# Altium project 20E-Bringup.PrjPcb (part 1 of 2)
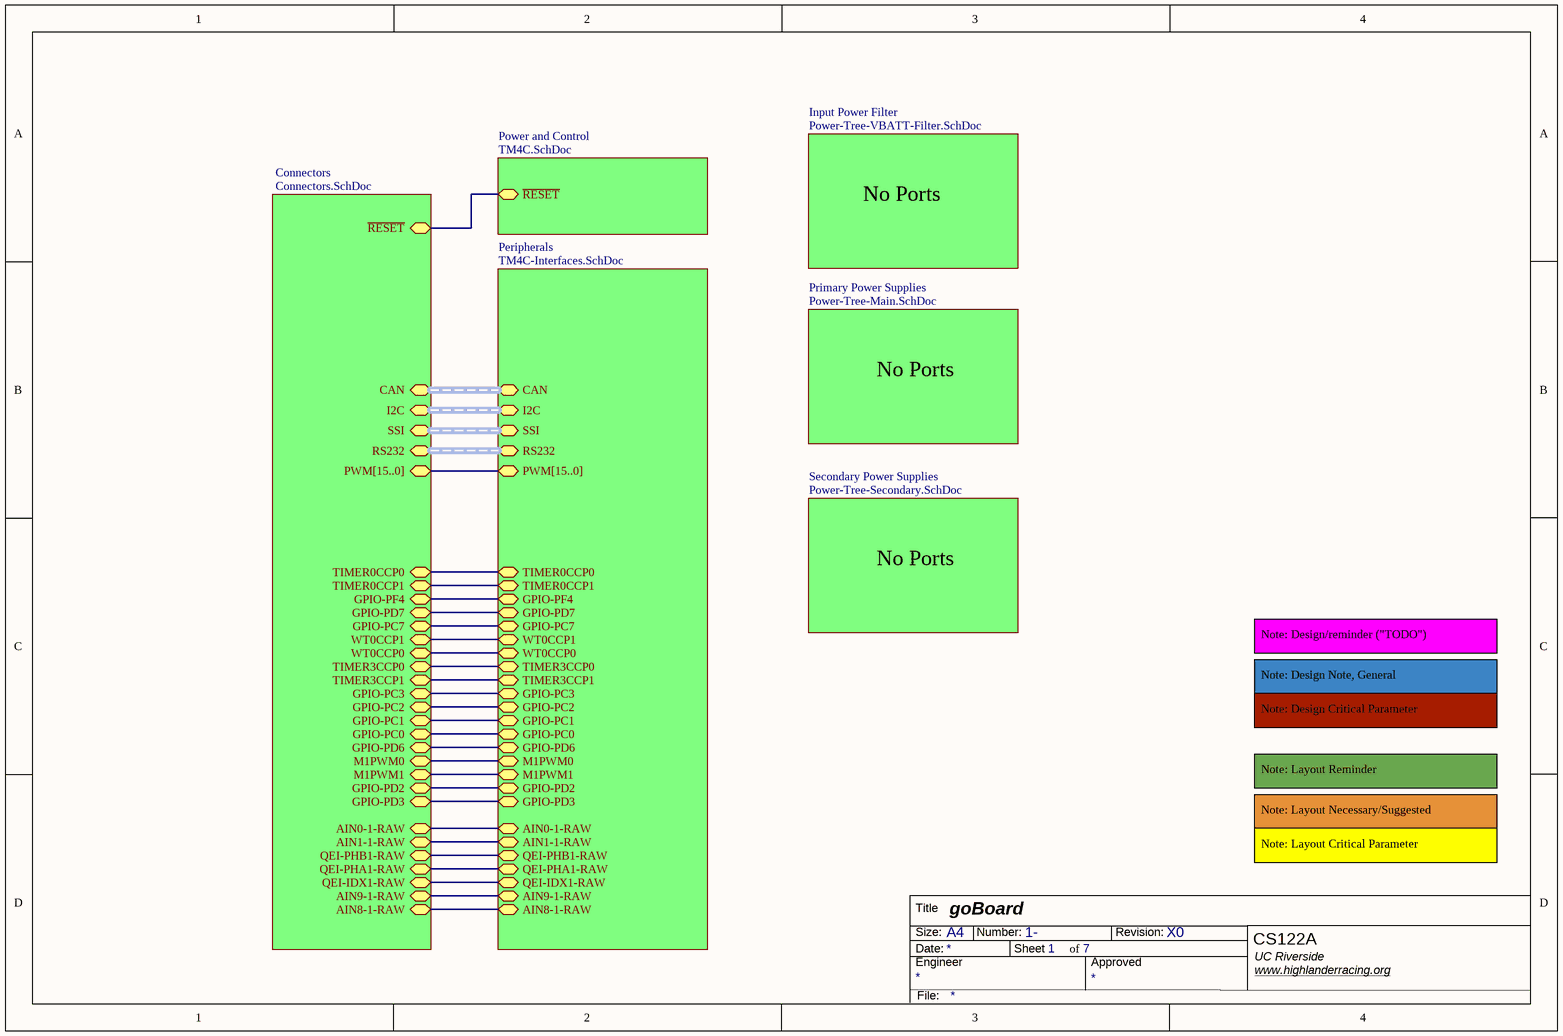
[diagram p0: System.SchDoc]
Revision: X0
12 sheets, 219 parts. Net scope: hierarchical (ports join the sheet entries above them; power ports are global).
Board files: dev-Carry-Rev0.PcbDoc, proto-rev0.PcbDoc
Sheets:
  System.SchDoc
    Connectors = Connectors.SchDoc
    Input Power Filter = Power-Tree-VBATT-Filter.SchDoc
    Primary Power Supplies = Power-Tree-Main.SchDoc
    Secondary Power Supplies = Power-Tree-Secondary.SchDoc
    Power and Control = TM4C.SchDoc
    Peripherals = TM4C-Interfaces.SchDoc
      CAN-Interface = CAN-Interface.SchDoc
      UART-Interface = UART-Interface.SchDoc
      I2C-Interface = I2C-Interface.SchDoc
      Pin-Filters = Pin-Filters.SchDoc
      PWM-Generator = PWM-Generator.SchDoc

## Sheet System.SchDoc: goBoard
size A4; Engineer: Paul Schneider; Organization: CS122A; DocumentNumber: 1-; Revision: X0; SheetNumber: 1; SheetTotal: 7; IsUserConfigurable: Yes

### Sub-sheets
Connectors = Connectors.SchDoc: CAN (bidir, harness CAN), TIMER0CCP0 (bidir), TIMER0CCP1 (bidir), GPIO-PF4 (bidir), GPIO-PD7 (bidir), GPIO-PC7 (bidir), WT0CCP1 (bidir), WT0CCP0 (bidir), TIMER3CCP0 (bidir), TIMER3CCP1 (bidir), GPIO-PC3 (bidir), GPIO-PC2 (bidir), GPIO-PC1 (bidir), GPIO-PC0 (bidir), GPIO-PD6 (bidir), M1PWM0 (bidir), M1PWM1 (bidir), GPIO-PD2 (bidir), GPIO-PD3 (bidir), AIN0-1-RAW (bidir), AIN1-1-RAW (bidir), QEI-PHB1-RAW (bidir), QEI-PHA1-RAW (bidir), QEI-IDX1-RAW (bidir), AIN9-1-RAW (bidir), AIN8-1-RAW (bidir), SSI (bidir, harness SSI), I2C (bidir, harness I2C), RS232 (bidir, harness RS232), PWM[15..0] (bidir), ~{RESET} (bidir)
Input Power Filter = Power-Tree-VBATT-Filter.SchDoc: no entries
Peripherals = TM4C-Interfaces.SchDoc: CAN (bidir, harness CAN), TIMER0CCP0 (bidir), TIMER0CCP1 (bidir), GPIO-PF4 (bidir), GPIO-PD7 (bidir), GPIO-PC7 (bidir), WT0CCP1 (bidir), WT0CCP0 (bidir), TIMER3CCP0 (bidir), TIMER3CCP1 (bidir), GPIO-PC3 (bidir), GPIO-PC2 (bidir), GPIO-PC1 (bidir), GPIO-PC0 (bidir), GPIO-PD6 (bidir), M1PWM0 (bidir), M1PWM1 (bidir), GPIO-PD2 (bidir), GPIO-PD3 (bidir), AIN0-1-RAW (bidir), AIN1-1-RAW (bidir), QEI-PHB1-RAW (bidir), QEI-PHA1-RAW (bidir), QEI-IDX1-RAW (bidir), AIN9-1-RAW (bidir), AIN8-1-RAW (bidir), PWM[15..0] (bidir), I2C (bidir, harness I2C), SSI (bidir, harness SSI), RS232 (bidir, harness RS232)
Power and Control = TM4C.SchDoc: ~{RESET} (bidir)
Primary Power Supplies = Power-Tree-Main.SchDoc: no entries
Secondary Power Supplies = Power-Tree-Secondary.SchDoc: no entries

### Nets
GPIO-PC0: sheet Connectors/GPIO-PC0, sheet Peripherals/GPIO-PC0
GPIO-PC1: sheet Connectors/GPIO-PC1, sheet Peripherals/GPIO-PC1
GPIO-PC2: sheet Connectors/GPIO-PC2, sheet Peripherals/GPIO-PC2
GPIO-PC3: sheet Connectors/GPIO-PC3, sheet Peripherals/GPIO-PC3
GPIO-PC7: sheet Connectors/GPIO-PC7, sheet Peripherals/GPIO-PC7
GPIO-PD2: sheet Connectors/GPIO-PD2, sheet Peripherals/GPIO-PD2
GPIO-PD3: sheet Connectors/GPIO-PD3, sheet Peripherals/GPIO-PD3
GPIO-PD6: sheet Connectors/GPIO-PD6, sheet Peripherals/GPIO-PD6
GPIO-PD7: sheet Connectors/GPIO-PD7, sheet Peripherals/GPIO-PD7
GPIO-PF4: sheet Connectors/GPIO-PF4, sheet Peripherals/GPIO-PF4
M1PWM0: sheet Connectors/M1PWM0, sheet Peripherals/M1PWM0
M1PWM1: sheet Connectors/M1PWM1, sheet Peripherals/M1PWM1
TIMER0CCP0: sheet Connectors/TIMER0CCP0, sheet Peripherals/TIMER0CCP0
TIMER0CCP1: sheet Connectors/TIMER0CCP1, sheet Peripherals/TIMER0CCP1
TIMER3CCP0: sheet Connectors/TIMER3CCP0, sheet Peripherals/TIMER3CCP0
TIMER3CCP1: sheet Connectors/TIMER3CCP1, sheet Peripherals/TIMER3CCP1
WT0CCP0: sheet Connectors/WT0CCP0, sheet Peripherals/WT0CCP0
WT0CCP1: sheet Connectors/WT0CCP1, sheet Peripherals/WT0CCP1
NetC4_2: sheet Connectors/~{RESET}, sheet Power and Control/~{RESET}
NetP21_1: sheet Connectors/QEI-IDX1-RAW, sheet Peripherals/QEI-IDX1-RAW
NetP21_2: sheet Connectors/AIN8-1-RAW, sheet Peripherals/AIN8-1-RAW
NetP21_3: sheet Connectors/QEI-PHA1-RAW, sheet Peripherals/QEI-PHA1-RAW
NetP21_4: sheet Connectors/AIN9-1-RAW, sheet Peripherals/AIN9-1-RAW
NetP21_5: sheet Connectors/QEI-PHB1-RAW, sheet Peripherals/QEI-PHB1-RAW
NetP21_6: sheet Connectors/AIN0-1-RAW, sheet Peripherals/AIN0-1-RAW
NetP21_8: sheet Connectors/AIN1-1-RAW, sheet Peripherals/AIN1-1-RAW

### Buses and harness runs
bus sheet Connectors/PWM[15..0] = sheet Peripherals/PWM[15..0]
harness sheet Connectors/CAN = sheet Peripherals/CAN
harness sheet Connectors/I2C = sheet Peripherals/I2C
harness sheet Connectors/RS232 = sheet Peripherals/RS232
harness sheet Connectors/SSI = sheet Peripherals/SSI

### Notes on the sheet
- No Ports
- Note: Design/reminder ("TODO")
- Note: Design Note, General
- Note: Design Critical Parameter
- Note: Layout Reminder
- Note: Layout Necessary/Suggested
- Note: Layout Critical Parameter
- Title
- Size:
- Date:
- Engineer
- A4
- Number:
- Sheet
- of
- Approved
- Revision:
- UC Riverside
- www.highlanderracing.org <https://www.highlanderracing.org>
- File:

## Sheet Connectors.SchDoc: HR20E
size A3; Organization: Highlander Racing; Address1: UC Riverside
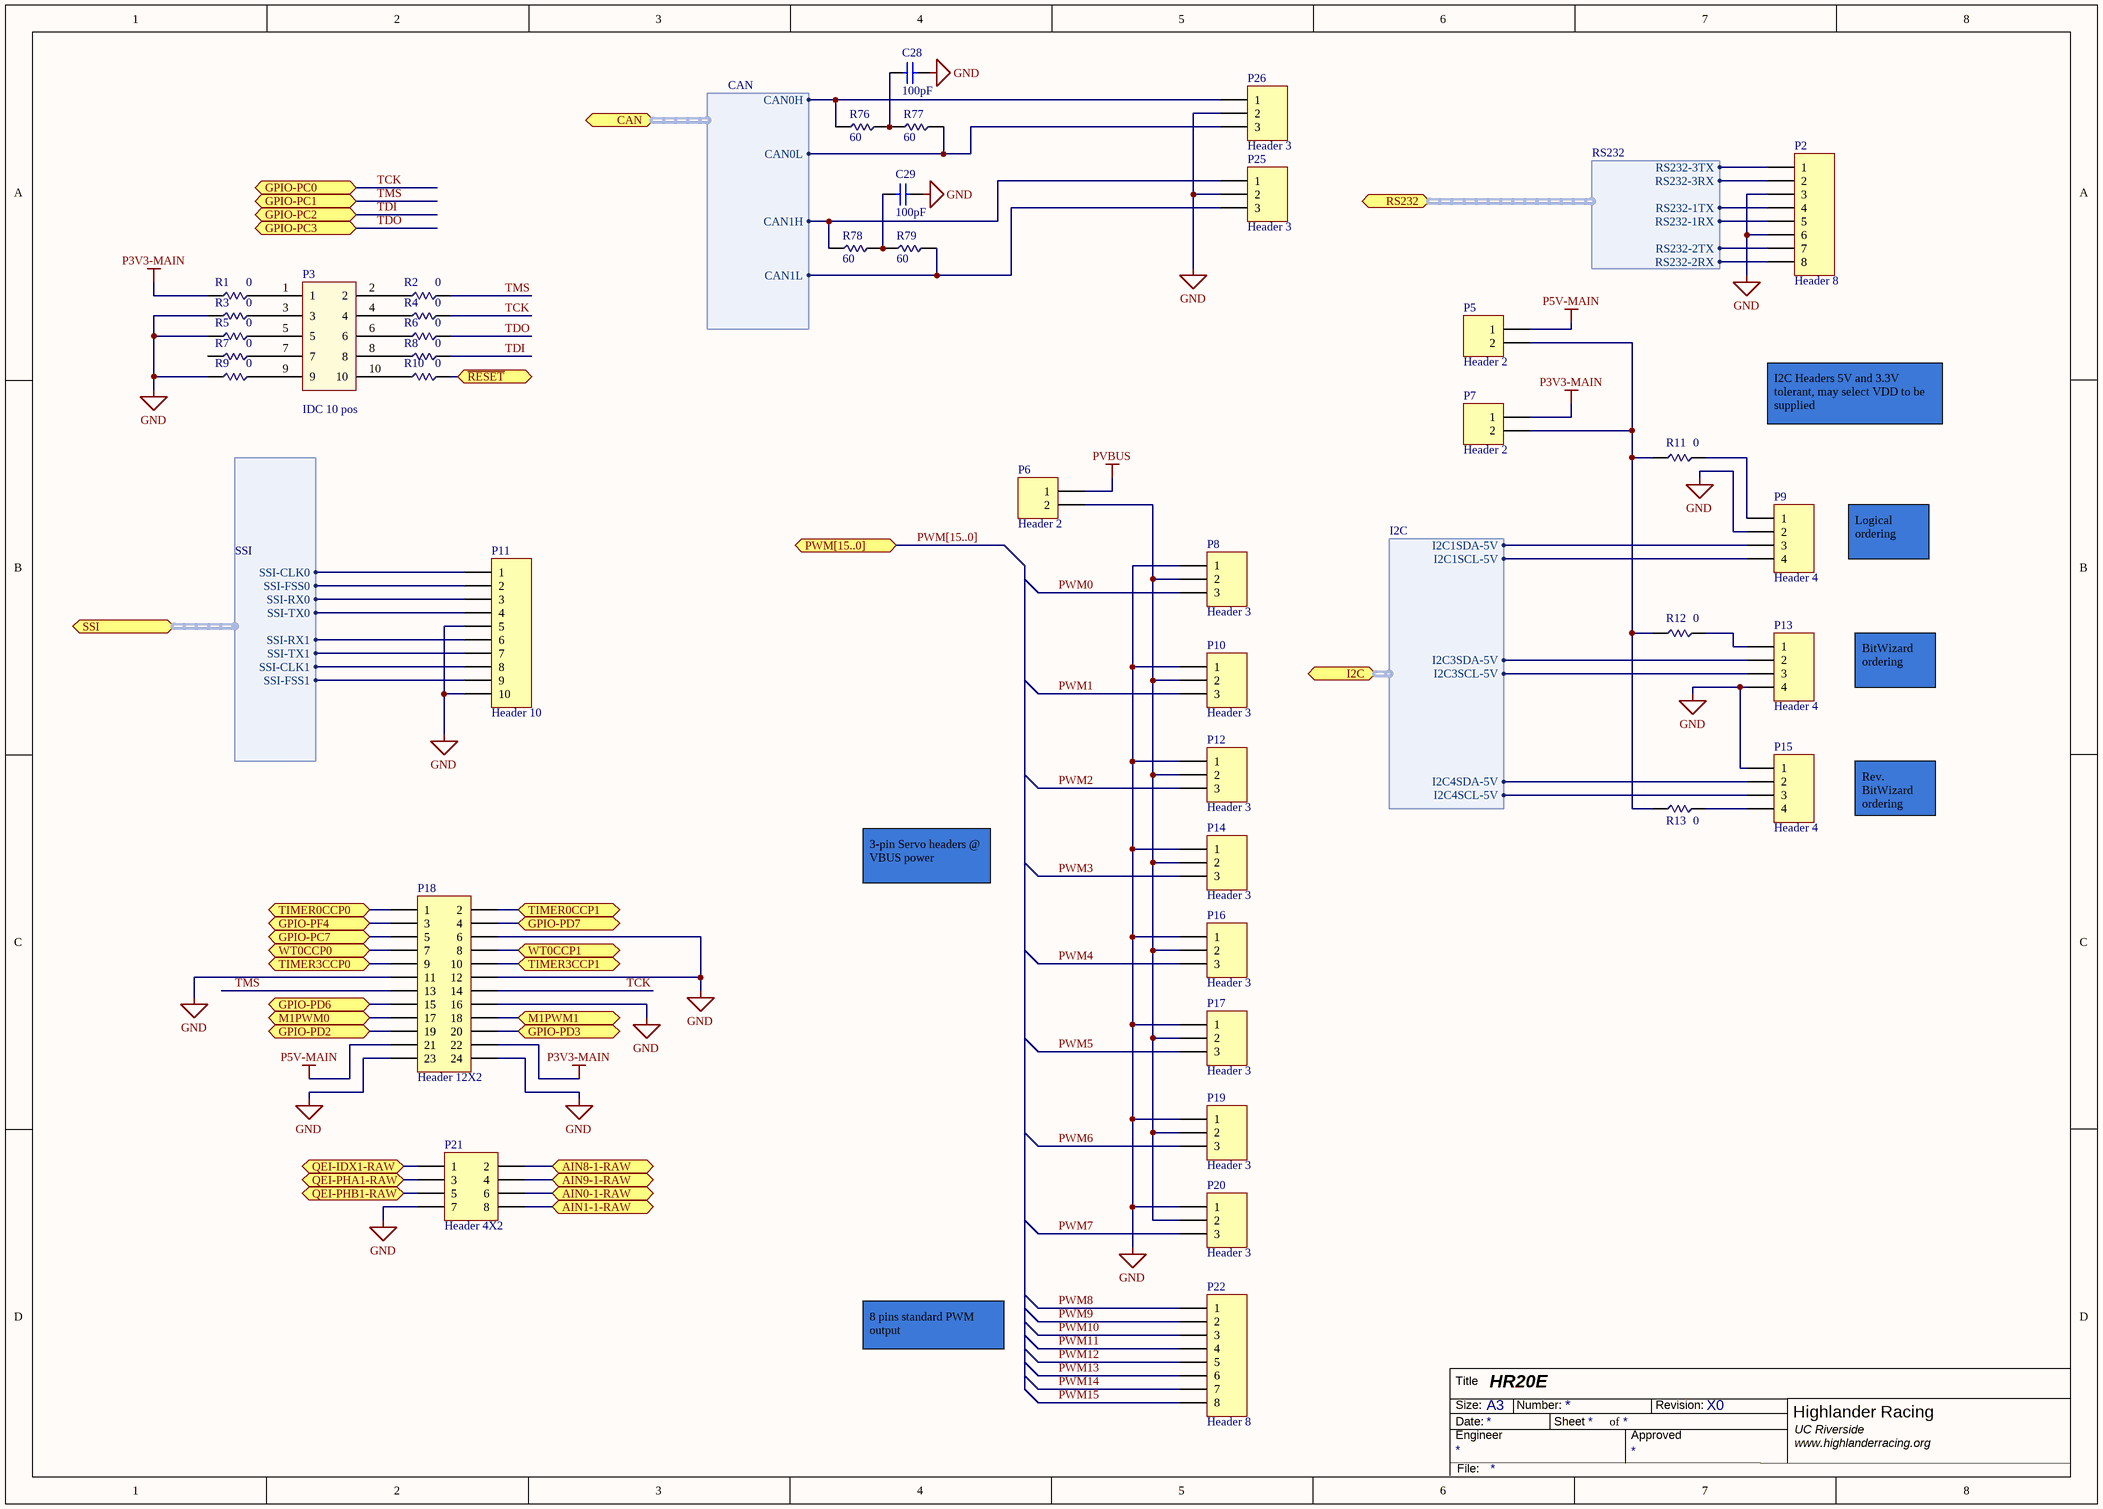
[diagram p1: Connectors.SchDoc]

### Parts
C28  value 100pF  [FOOTPRINT-0805-GEN]  (hidden comment: Capacitor-Generic-0805)
C29  value 100pF  [FOOTPRINT-0805-GEN]  (hidden comment: Capacitor-Generic-0805)
P2  Header 8  [HDR1X8]
P3  IDC 10 pos  [FOOTPRINT-GENERIC-10-HEADER-0MM5]
P5  Header 2  [HDR1X2]
P6  Header 2  [HDR1X2]
P7  Header 2  [HDR1X2]
P8  Header 3  [HDR1X3]
P9  Header 4  [HDR1X4]
P10  Header 3  [HDR1X3]
P11  Header 10  [HDR1X10]
P12  Header 3  [HDR1X3]
P13  Header 4  [HDR1X4]
P14  Header 3  [HDR1X3]
P15  Header 4  [HDR1X4]
P16  Header 3  [HDR1X3]
P17  Header 3  [HDR1X3]
P18  Header 12X2  [HDR2X12]
P19  Header 3  [HDR1X3]
P20  Header 3  [HDR1X3]
P21  Header 4X2  [HDR2X4]
P22  Header 8  [HDR1X8]
P25  Header 3  [HDR1X3]
P26  Header 3  [HDR1X3]
R1  value 0  [FOOTPRINT-0805-GEN]  (hidden comment: SMC)
R2  value 0  [FOOTPRINT-0805-GEN]  (hidden comment: SMC)
R3  value 0  [FOOTPRINT-0805-GEN]  (hidden comment: SMC)
R4  value 0  [FOOTPRINT-0805-GEN]  (hidden comment: SMC)
R5  value 0  [FOOTPRINT-0805-GEN]  (hidden comment: SMC)
R6  value 0  [FOOTPRINT-0805-GEN]  (hidden comment: SMC)
R7  value 0  [FOOTPRINT-0805-GEN]  (hidden comment: SMC)
R8  value 0  [FOOTPRINT-0805-GEN]  (hidden comment: SMC)
R9  value 0  [FOOTPRINT-0805-GEN]  (hidden comment: SMC)
R10  value 0  [FOOTPRINT-0805-GEN]  (hidden comment: SMC)
R11  value 0  [FOOTPRINT-0805-GEN]  (hidden comment: SMC)
R12  value 0  [FOOTPRINT-0805-GEN]  (hidden comment: SMC)
R13  value 0  [FOOTPRINT-0805-GEN]  (hidden comment: SMC)
R76  value 60  [FOOTPRINT-0805-GEN]  (hidden comment: SMC)
R77  value 60  [FOOTPRINT-0805-GEN]  (hidden comment: SMC)
R78  value 60  [FOOTPRINT-0805-GEN]  (hidden comment: SMC)
R79  value 60  [FOOTPRINT-0805-GEN]  (hidden comment: SMC)

### Ports
AIN0-1-RAW (bidir), AIN1-1-RAW (bidir), AIN8-1-RAW (bidir), AIN9-1-RAW (bidir), CAN (bidir, harness CAN), GPIO-PC0 (bidir), GPIO-PC1 (bidir), GPIO-PC2 (bidir), GPIO-PC3 (bidir), GPIO-PC7 (bidir), GPIO-PD2 (bidir), GPIO-PD3 (bidir), GPIO-PD6 (bidir), GPIO-PD7 (bidir), GPIO-PF4 (bidir), I2C (bidir, harness I2C), M1PWM0 (bidir), M1PWM1 (bidir), PWM[15..0] (bidir), QEI-IDX1-RAW (bidir), QEI-PHA1-RAW (bidir), QEI-PHB1-RAW (bidir), RS232 (bidir, harness RS232), SSI (bidir, harness SSI), TIMER0CCP0 (bidir), TIMER0CCP1 (bidir), TIMER3CCP0 (bidir), TIMER3CCP1 (bidir), WT0CCP0 (bidir), WT0CCP1 (bidir), ~{RESET} (bidir)

### Harnesses
SSI: SSI-TX1, SSI-CLK1, SSI-RX1, SSI-FSS1, SSI-CLK0, SSI-FSS0, SSI-RX0, SSI-TX0
CAN: CAN0H, CAN0L, CAN1H, CAN1L
I2C: I2C1SCL-5V, I2C1SDA-5V, I2C3SCL-5V, I2C3SDA-5V, I2C4SCL-5V, I2C4SDA-5V
RS232: RS232-1RX, RS232-1TX, RS232-2RX, RS232-2TX, RS232-3RX, RS232-3TX

### Nets
GND: C28.2 C29.2 P2.3 P2.6 P8.1 P9.2 P10.1 P11.5 P11.10 P12.1 P13.4 P14.1 P15.1 P16.1 P17.1 P18.6 P18.11 P18.12 P18.16 P18.23 P18.24 P19.1 P20.1 P21.7 P25.2 P26.2 R3.1 R5.1 R9.1
P3V3-MAIN: P7.1 P18.22 R1.1
P5V-MAIN: P5.1 P18.21
PVBUS: P6.1
GPIO-PC7: P18.5 ; port GPIO-PC7
GPIO-PD2: P18.19 ; port GPIO-PD2
GPIO-PD3: P18.20 ; port GPIO-PD3
GPIO-PD6: P18.15 ; port GPIO-PD6
GPIO-PD7: P18.4 ; port GPIO-PD7
GPIO-PF4: P18.3 ; port GPIO-PF4
M1PWM0: P18.17 ; port M1PWM0
M1PWM1: P18.18 ; port M1PWM1
PWM0: P8.3
PWM1: P10.3
PWM2: P12.3
PWM3: P14.3
PWM4: P16.3
PWM5: P17.3
PWM6: P19.3
PWM7: P20.3
PWM8: P22.1
PWM9: P22.2
PWM10: P22.3
PWM11: P22.4
PWM12: P22.5
PWM13: P22.6
PWM14: P22.7
PWM15: P22.8
TCK: P18.14 R4.2 ; port GPIO-PC0  [project net GPIO-PC0]
TDI: R8.2 ; port GPIO-PC2  [project net GPIO-PC2]
TDO: R6.2 ; port GPIO-PC3  [project net GPIO-PC3]
TIMER0CCP0: P18.1 ; port TIMER0CCP0
TIMER0CCP1: P18.2 ; port TIMER0CCP1
TIMER3CCP0: P18.9 ; port TIMER3CCP0
TIMER3CCP1: P18.10 ; port TIMER3CCP1
TMS: P18.13 R2.2 ; port GPIO-PC1  [project net GPIO-PC1]
WT0CCP0: P18.7 ; port WT0CCP0
WT0CCP1: P18.8 ; port WT0CCP1
NetC4_2: R10.2 ; port ~{RESET}
NetC28_1: C28.1 R76.1 R77.2
NetC29_1: C29.1 R78.1 R79.2
NetP2_1: P2.1 ; port RS232.RS232-3TX
NetP2_2: P2.2 ; port RS232.RS232-3RX
NetP2_4: P2.4 ; port RS232.RS232-1TX
NetP2_5: P2.5 ; port RS232.RS232-1RX
NetP2_7: P2.7 ; port RS232.RS232-2TX
NetP2_8: P2.8 ; port RS232.RS232-2RX
NetP3_1: P3.1 R1.2
NetP3_2: P3.2 R2.1
NetP3_3: P3.3 R3.2
NetP3_4: P3.4 R4.1
NetP3_5: P3.5 R5.2
NetP3_6: P3.6 R6.1
NetP3_7: P3.7 R7.2
NetP3_8: P3.8 R8.1
NetP3_9: P3.9 R9.2
NetP3_10: P3.10 R10.1
NetP5_2: P5.2 P7.2 R11.1 R12.1 R13.1
NetP6_2: P6.2 P8.2 P10.2 P12.2 P14.2 P16.2 P17.2 P19.2 P20.2
NetP9_1: P9.1 R11.2
NetP9_3: P9.3 ; port I2C.I2C1SDA-5V
NetP9_4: P9.4 ; port I2C.I2C1SCL-5V
NetP11_1: P11.1 ; port SSI.SSI-CLK0
NetP11_2: P11.2 ; port SSI.SSI-FSS0
NetP11_3: P11.3 ; port SSI.SSI-RX0
NetP11_4: P11.4 ; port SSI.SSI-TX0
NetP11_6: P11.6 ; port SSI.SSI-RX1
NetP11_7: P11.7 ; port SSI.SSI-TX1
NetP11_8: P11.8 ; port SSI.SSI-CLK1
NetP11_9: P11.9 ; port SSI.SSI-FSS1
NetP13_1: P13.1 R12.2
NetP13_2: P13.2 ; port I2C.I2C3SDA-5V
NetP13_3: P13.3 ; port I2C.I2C3SCL-5V
NetP15_2: P15.2 ; port I2C.I2C4SDA-5V
NetP15_3: P15.3 ; port I2C.I2C4SCL-5V
NetP15_4: P15.4 R13.2
NetP21_1: P21.1 ; port QEI-IDX1-RAW
NetP21_2: P21.2 ; port AIN8-1-RAW
NetP21_3: P21.3 ; port QEI-PHA1-RAW
NetP21_4: P21.4 ; port AIN9-1-RAW
NetP21_5: P21.5 ; port QEI-PHB1-RAW
NetP21_6: P21.6 ; port AIN0-1-RAW
NetP21_8: P21.8 ; port AIN1-1-RAW
NetP25_1: P25.1 R78.2 ; port CAN.CAN1H
NetP25_3: P25.3 R79.1 ; port CAN.CAN1L
NetP26_1: P26.1 R76.2 ; port CAN.CAN0H
NetP26_3: P26.3 R77.1 ; port CAN.CAN0L

Not connected (* = marked no-connect by the designer): R7 1

### Buses and harness runs
bus PWM[15..0] = port PWM[15..0]

### Notes on the sheet
- I2C Headers 5V and 3.3V tolerant, may select VDD to be supplied
- Logical ordering
- BitWizard ordering
- Rev. BitWizard ordering
- 3-pin Servo headers @ VBUS power
- 8 pins standard PWM output
- Title
- Size:
- Date:
- Engineer
- A3
- Number:
- Sheet
- of
- Approved
- Revision:
- UC Riverside
- www.highlanderracing.org <http://www.highlanderracing.org>
- File:

### Library data of the parts
C28 C29 = Capacitor-Generic-0805: Capacitor; Published: 8-Jun-2000; LatestRevisionDate: 17-Jul-2002; LatestRevisionNote: Re-released for DXP Platform.; PackageReference: RAD-0.3; Publisher: Altium Limited; PackageDescription: Radial Cap, Thru-Hole; 2 Leads; 0.3 in Pin Spacing
P2 P22 = Header 8: Header, 8-Pin; LatestRevisionDate: 17-Jul-2002; LatestRevisionNote: Re-released for DXP Platform.; Publisher: Altium Limited
P3 = Connector-Generic-Header-10-0mm5
P5-P7 = Header 2: Header, 2-Pin; LatestRevisionDate: 17-Jul-2002; LatestRevisionNote: Re-released for DXP Platform.; Publisher: Altium Limited
P8 P10 P12 P14 P16 P17 P19 P20 P25 P26 = Header 3: Header, 3-Pin; LatestRevisionDate: 17-Jul-2002; LatestRevisionNote: Re-released for DXP Platform.; Publisher: Altium Limited
P9 P13 P15 = Header 4: Header, 4-Pin; LatestRevisionDate: 17-Jul-2002; LatestRevisionNote: Re-released for DXP Platform.; Publisher: Altium Limited
P11 = Header 10: Header, 10-Pin; LatestRevisionDate: 17-Jul-2002; LatestRevisionNote: Re-released for DXP Platform.; Publisher: Altium Limited
P18 = Header 12X2: Header, 12-Pin, Dual row; LatestRevisionDate: 17-Jul-2002; LatestRevisionNote: Re-released for DXP Platform.; Publisher: Altium Limited
P21 = Header 4X2: Header, 4-Pin, Dual row; LatestRevisionDate: 17-Jul-2002; LatestRevisionNote: Re-released for DXP Platform.; Publisher: Altium Limited
R1-R13 R76-R79 = Resistor-Generic-0805-2012: 1/8 Watt Surface Mount Resistor

## Sheet Power-Tree-VBATT-Filter.SchDoc
size A4; DocumentNumber: 3-; SheetNumber: 3; SheetTotal: 7
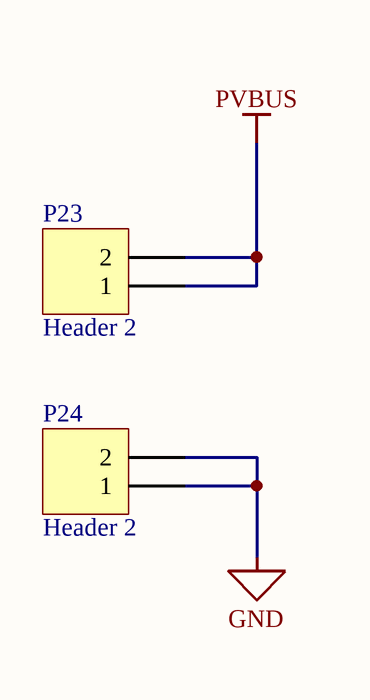
[diagram p2: Power-Tree-VBATT-Filter.SchDoc]

### Parts
P23  Header 2  [HDR1X2]
P24  Header 2  [HDR1X2]

### Nets
GND: P24.1 P24.2
PVBUS: P23.1 P23.2

### Notes on the sheet
- Title
- Size:
- Date:
- Engineer
- A4
- Number:
- Sheet
- of
- Approved
- Revision:
- UC Riverside
- www.highlanderracing.org <https://www.highlanderracing.org>
- File:

### Library data of the parts
P23 P24 = Header 2: Header, 2-Pin; LatestRevisionDate: 17-Jul-2002; LatestRevisionNote: Re-released for DXP Platform.; Publisher: Altium Limited

## Sheet Power-Tree-Main.SchDoc
size A3; DocumentNumber: 4-; SheetNumber: 4; SheetTotal: 7
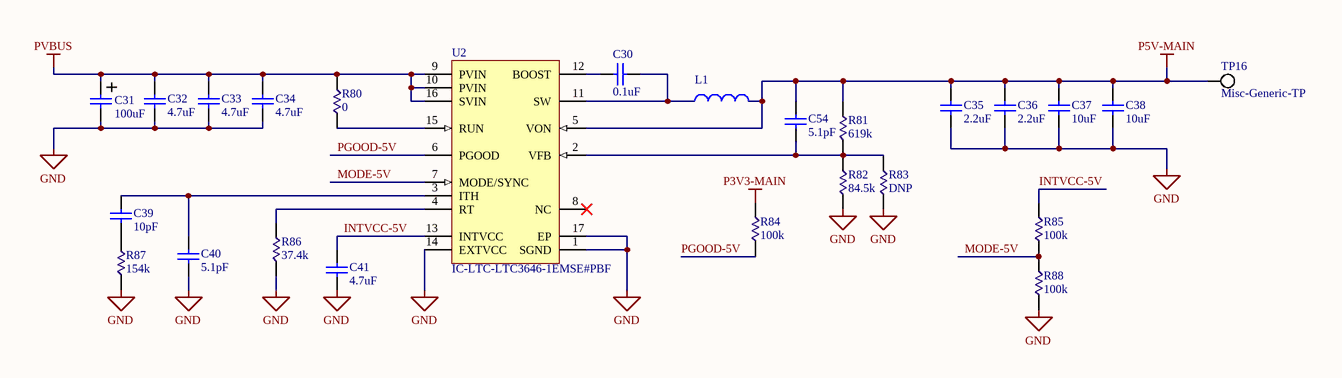
[diagram p3: Power-Tree-Main.SchDoc]

### Parts
C30  value 0.1uF  [FOOTPRINT-0805-GEN]  (hidden comment: Capacitor-Generic-0805)
C31  value 100uF  [FOOTPRINT-NIPPON-JA0]  (hidden comment: Capacitor-Nippon-HHXC350ARA470MF80G)
C32  value 4.7uF  [FOOTPRINT-1206-GEN]  (hidden comment: C1206C475K5RACAUTO)
C33  value 4.7uF  [FOOTPRINT-1206-GEN]  (hidden comment: C1206C475K5RACAUTO)
C34  value 4.7uF  [FOOTPRINT-1206-GEN]  (hidden comment: C1206C475K5RACAUTO)
C35  value 2.2uF  [FOOTPRINT-0805-GEN]  (hidden comment: C0805C225K8PAC)
C36  value 2.2uF  [FOOTPRINT-0805-GEN]  (hidden comment: C0805C225K8PAC)
C37  value 10uF  [FOOTPRINT-0805-GEN]  (hidden comment: C0805C106K8PAC)
C38  value 10uF  [FOOTPRINT-0805-GEN]  (hidden comment: C0805C106K8PAC)
C39  value 10pF  [FOOTPRINT-0805-GEN]  (hidden comment: C0805C100J3HACTU)
C40  value 5.1pF  [FOOTPRINT-0805-GEN]  (hidden comment: C0805C519K5GACTU)
C41  value 4.7uF  [FOOTPRINT-0805-GEN]  (hidden comment: C0805C475K8PAC)
C54  value 5.1pF  [FOOTPRINT-0805-GEN]  (hidden comment: C0805C519K5GACTU)
L1  Inductor-Bourns-SRP7050TA-2R2M  [FOOTPRINT-BOURNS-SRP7050TA]  (value not drawn)
R80  value 0  [FOOTPRINT-0805-GEN]  (hidden comment: SMC)
R81  value 619k  [FOOTPRINT-0805-GEN]  (hidden comment: SMC)
R82  value 84.5k  [FOOTPRINT-0805-GEN]  (hidden comment: SMC)
R83  value DNP  [FOOTPRINT-0805-GEN]  (hidden comment: Trim, 0 ohm)
R84  value 100k  [FOOTPRINT-0805-GEN]  (hidden comment: SMC)
R85  value 100k  [FOOTPRINT-0805-GEN]  (hidden comment: SMC)
R86  value 37.4k  [FOOTPRINT-0805-GEN]  (hidden comment: SMC)
R87  value 154k  [FOOTPRINT-0805-GEN]  (hidden comment: SMC)
R88  value 100k  [FOOTPRINT-0805-GEN]  (hidden comment: SMC)
TP16  Misc-Generic-TP  [FOOTPRINT-GENERIC-TP-VIA-1MM5]
U2  IC-LTC-LTC3646-1EMSE#PBF  [FOOTPRINT-LTC-LTC3646]

### Nets
GND: C31.2 C32.1 C33.1 C34.1 C35.2 C36.2 C37.1 C38.1 C40.1 C41.1 R82.2 R83.2 R86.1 R87.1 R88.1 U2.1(SGND) U2.14(EXTVCC) U2.17(EP)
P3V3-MAIN: R84.2
P5V-MAIN: C35.1 C36.1 C37.2 C38.2 C54.2 L1.2 R81.2 TP16.1(TP) U2.5(VON)
PVBUS: C31.1 C32.2 C33.2 C34.2 R80.1 U2.9(PVIN) U2.10(PVIN) U2.16(SVIN)
INTVCC-5V: C41.2 R85.2 U2.13(INTVCC)
MODE-5V: R85.1 R88.2 U2.7(MODE/SYNC)
PGOOD-5V: R84.1 U2.6(PGOOD)
NetC30_1: C30.1 L1.1 U2.11(SW)
NetC30_2: C30.2 U2.12(BOOST)
NetC39_1: C39.1 R87.2
NetC39_2: C39.2 C40.2 U2.3(ITH)
NetC54_1: C54.1 R81.1 R82.1 R83.1 U2.2(VFB)
NetR80_2: R80.2 U2.15(RUN)
NetR86_2: R86.2 U2.4(RT)

Not connected (* = marked no-connect by the designer): U2 8(NC)*

### Notes on the sheet
- Title
- Size:
- Date:
- Engineer
- A3
- Number:
- Sheet
- of
- Approved
- Revision:
- UC Riverside
- www.highlanderracing.org <http://www.highlanderracing.org>
- File:
- (in symbol Capacitor-Nippon-HHXC350ARA470MF80G) +

### Library data of the parts
C30 C40 C54 = Capacitor-Generic-0805: Capacitor; Published: 8-Jun-2000; LatestRevisionDate: 17-Jul-2002; LatestRevisionNote: Re-released for DXP Platform.; PackageReference: RAD-0.3; Publisher: Altium Limited; PackageDescription: Radial Cap, Thru-Hole; 2 Leads; 0.3 in Pin Spacing
C31 = Capacitor-Nippon-HHXC350ARA470MF80G: CAP ALUM POLY 100UF 20% 50V SMD
C32-C34 = Capacitor-Generic-1206: CAP CER 1206 4.7UF 50V X7R 10%; Published: 8-Jun-2000; LatestRevisionDate: 17-Jul-2002; LatestRevisionNote: Re-released for DXP Platform.; PackageReference: RAD-0.3; Publisher: Altium Limited; PackageDescription: Radial Cap, Thru-Hole; 2 Leads; 0.3 in Pin Spacing
C35 C36 = Capacitor-Generic-0805: CAP CER 2.2UF 10V X5R 0805; Published: 8-Jun-2000; LatestRevisionDate: 17-Jul-2002; LatestRevisionNote: Re-released for DXP Platform.; PackageReference: RAD-0.3; Publisher: Altium Limited; PackageDescription: Radial Cap, Thru-Hole; 2 Leads; 0.3 in Pin Spacing
C37 C38 = Capacitor-Generic-0805: CAP CER 10UF 10V X5R 0805; Published: 8-Jun-2000; LatestRevisionDate: 17-Jul-2002; LatestRevisionNote: Re-released for DXP Platform.; PackageReference: RAD-0.3; Publisher: Altium Limited; PackageDescription: Radial Cap, Thru-Hole; 2 Leads; 0.3 in Pin Spacing
C39 = Capacitor-Generic-0805: CAP CER 0805 10PF 25V ULTRA STAB; Published: 8-Jun-2000; LatestRevisionDate: 17-Jul-2002; LatestRevisionNote: Re-released for DXP Platform.; PackageReference: RAD-0.3; Publisher: Altium Limited; PackageDescription: Radial Cap, Thru-Hole; 2 Leads; 0.3 in Pin Spacing
C41 = Capacitor-Generic-0805: CAP CER 4.7UF 10V X5R 0805; Published: 8-Jun-2000; LatestRevisionDate: 17-Jul-2002; LatestRevisionNote: Re-released for DXP Platform.; PackageReference: RAD-0.3; Publisher: Altium Limited; PackageDescription: Radial Cap, Thru-Hole; 2 Leads; 0.3 in Pin Spacing
L1 = Inductor-Bourns-SRP7050TA-2R2M: FIXED IND 2.2UH 10A 12 MOHM SMD
R80-R88 = Resistor-Generic-0805-2012: 1/8 Watt Surface Mount Resistor
U2 = IC-LTC-LTC3646-1EMSE#PBF: 1 A Synchronous Step-Down Converter, 16-pin SOP (MSE-16-EDP), -40 to 85 degC, Pb-Free; PartNumber: LTC3646EMSE#PBF; Manufacturer: Linear Technology; Number of Outputs: 1; Frequency Adjust Range: 200kHz - 3MHz; ComponentLink3Description: Package Specification; PackageReference: MSE-16; ComponentLink2URL: http://cds.linear.com/docs/en/datasheet/36461fa.pdf; ComponentLink1Description: Manufacturer URL; RoHS: TRUE; ComponentLink3URL: http://cds.linear.com/docs/en/packaging/05081667_F_MSE16.pdf; PackageVersion: Rev. F, 05/2013; Mounting Technology: Surface Mount; ComponentLink1URL: http://www.linear.com/; ComponentLink2Description: Datasheet; PackageDescription: 16-Pin Plastic MSOP, Exposed Die Pad, Body 4.039 x 3 mm, Pitch 0.5 mm

## Sheet Power-Tree-Secondary.SchDoc
size A3; DocumentNumber: 5-; SheetNumber: 5; SheetTotal: 7
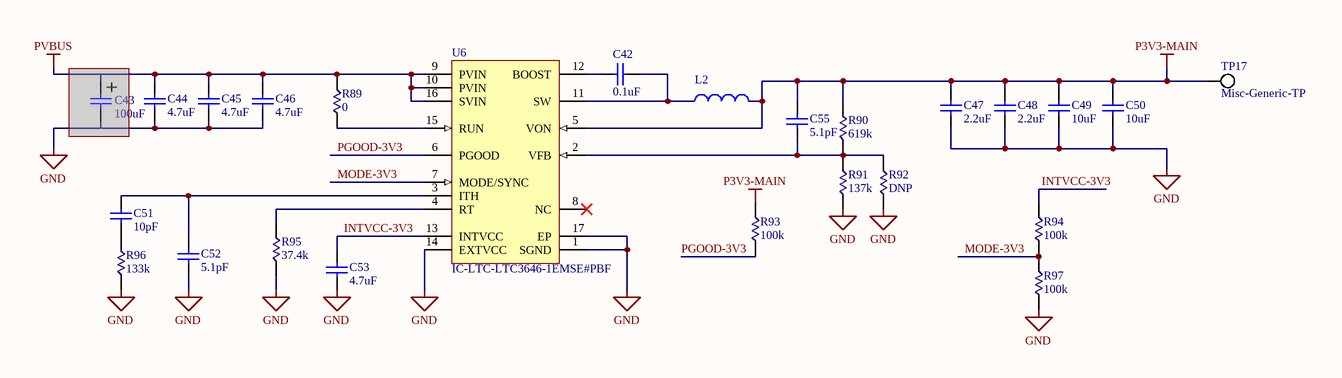
[diagram p4: Power-Tree-Secondary.SchDoc]

### Parts
C42  value 0.1uF  [FOOTPRINT-0805-GEN]  (hidden comment: Capacitor-Generic-0805)
C43  value 100uF  [FOOTPRINT-NIPPON-JA0]  (hidden comment: Capacitor-Nippon-HHXC350ARA470MF80G)  (masked out: inside a compile mask, not in the netlist)
C44  value 4.7uF  [FOOTPRINT-1206-GEN]  (hidden comment: C1206C475K5RACAUTO)
C45  value 4.7uF  [FOOTPRINT-1206-GEN]  (hidden comment: C1206C475K5RACAUTO)
C46  value 4.7uF  [FOOTPRINT-1206-GEN]  (hidden comment: C1206C475K5RACAUTO)
C47  value 2.2uF  [FOOTPRINT-0805-GEN]  (hidden comment: C0805C225K8PAC)
C48  value 2.2uF  [FOOTPRINT-0805-GEN]  (hidden comment: C0805C225K8PAC)
C49  value 10uF  [FOOTPRINT-0805-GEN]  (hidden comment: C0805C106K8PAC)
C50  value 10uF  [FOOTPRINT-0805-GEN]  (hidden comment: C0805C106K8PAC)
C51  value 10pF  [FOOTPRINT-0805-GEN]  (hidden comment: C0805C100J3HACTU)
C52  value 5.1pF  [FOOTPRINT-0805-GEN]  (hidden comment: C0805C519K5GACTU)
C53  value 4.7uF  [FOOTPRINT-0805-GEN]  (hidden comment: C0805C475K8PAC)
C55  value 5.1pF  [FOOTPRINT-0805-GEN]  (hidden comment: C0805C519K5GACTU)
L2  Inductor-Bourns-SRP7050TA-2R2M  [FOOTPRINT-BOURNS-SRP7050TA]  (value not drawn)
R89  value 0  [FOOTPRINT-0805-GEN]  (hidden comment: SMC)
R90  value 619k  [FOOTPRINT-0805-GEN]  (hidden comment: SMC)
R91  value 137k  [FOOTPRINT-0805-GEN]  (hidden comment: SMC)
R92  value DNP  [FOOTPRINT-0805-GEN]  (hidden comment: Trim, 0 ohm)
R93  value 100k  [FOOTPRINT-0805-GEN]  (hidden comment: SMC)
R94  value 100k  [FOOTPRINT-0805-GEN]  (hidden comment: SMC)
R95  value 37.4k  [FOOTPRINT-0805-GEN]  (hidden comment: SMC)
R96  value 133k  [FOOTPRINT-0805-GEN]  (hidden comment: SMC)
R97  value 100k  [FOOTPRINT-0805-GEN]  (hidden comment: SMC)
TP17  Misc-Generic-TP  [FOOTPRINT-GENERIC-TP-VIA-1MM5]
U6  IC-LTC-LTC3646-1EMSE#PBF  [FOOTPRINT-LTC-LTC3646]

### Nets
GND: C44.1 C45.1 C46.1 C47.2 C48.2 C49.1 C50.1 C52.1 C53.1 R91.2 R92.2 R95.1 R96.1 R97.1 U6.1(SGND) U6.14(EXTVCC) U6.17(EP)
P3V3-MAIN: C47.1 C48.1 C49.2 C50.2 C55.2 L2.2 R90.2 R93.2 TP17.1(TP) U6.5(VON)
PVBUS: C44.2 C45.2 C46.2 R89.1 U6.9(PVIN) U6.10(PVIN) U6.16(SVIN)
INTVCC-3V3: C53.2 R94.2 U6.13(INTVCC)
MODE-3V3: R94.1 R97.2 U6.7(MODE/SYNC)
PGOOD-3V3: R93.1 U6.6(PGOOD)
NetC42_1: C42.1 L2.1 U6.11(SW)
NetC42_2: C42.2 U6.12(BOOST)
NetC51_1: C51.1 R96.2
NetC51_2: C51.2 C52.2 U6.3(ITH)
NetC55_1: C55.1 R90.1 R91.1 R92.1 U6.2(VFB)
NetR89_2: R89.2 U6.15(RUN)
NetR95_2: R95.2 U6.4(RT)

Not connected (* = marked no-connect by the designer): U6 8(NC)*

### Notes on the sheet
- Title
- Size:
- Date:
- Engineer
- A3
- Number:
- Sheet
- of
- Approved
- Revision:
- UC Riverside
- www.highlanderracing.org <http://www.highlanderracing.org>
- File:
- (in symbol Capacitor-Nippon-HHXC350ARA470MF80G) +

### Library data of the parts
C42 C52 C55 = Capacitor-Generic-0805: Capacitor; Published: 8-Jun-2000; LatestRevisionDate: 17-Jul-2002; LatestRevisionNote: Re-released for DXP Platform.; PackageReference: RAD-0.3; Publisher: Altium Limited; PackageDescription: Radial Cap, Thru-Hole; 2 Leads; 0.3 in Pin Spacing
C43 = Capacitor-Nippon-HHXC350ARA470MF80G: CAP ALUM POLY 100UF 20% 50V SMD
C44-C46 = Capacitor-Generic-1206: CAP CER 1206 4.7UF 50V X7R 10%; Published: 8-Jun-2000; LatestRevisionDate: 17-Jul-2002; LatestRevisionNote: Re-released for DXP Platform.; PackageReference: RAD-0.3; Publisher: Altium Limited; PackageDescription: Radial Cap, Thru-Hole; 2 Leads; 0.3 in Pin Spacing
C47 C48 = Capacitor-Generic-0805: CAP CER 2.2UF 10V X5R 0805; Published: 8-Jun-2000; LatestRevisionDate: 17-Jul-2002; LatestRevisionNote: Re-released for DXP Platform.; PackageReference: RAD-0.3; Publisher: Altium Limited; PackageDescription: Radial Cap, Thru-Hole; 2 Leads; 0.3 in Pin Spacing
C49 C50 = Capacitor-Generic-0805: CAP CER 10UF 10V X5R 0805; Published: 8-Jun-2000; LatestRevisionDate: 17-Jul-2002; LatestRevisionNote: Re-released for DXP Platform.; PackageReference: RAD-0.3; Publisher: Altium Limited; PackageDescription: Radial Cap, Thru-Hole; 2 Leads; 0.3 in Pin Spacing
C51 = Capacitor-Generic-0805: CAP CER 0805 10PF 25V ULTRA STAB; Published: 8-Jun-2000; LatestRevisionDate: 17-Jul-2002; LatestRevisionNote: Re-released for DXP Platform.; PackageReference: RAD-0.3; Publisher: Altium Limited; PackageDescription: Radial Cap, Thru-Hole; 2 Leads; 0.3 in Pin Spacing
C53 = Capacitor-Generic-0805: CAP CER 4.7UF 10V X5R 0805; Published: 8-Jun-2000; LatestRevisionDate: 17-Jul-2002; LatestRevisionNote: Re-released for DXP Platform.; PackageReference: RAD-0.3; Publisher: Altium Limited; PackageDescription: Radial Cap, Thru-Hole; 2 Leads; 0.3 in Pin Spacing
L2 = Inductor-Bourns-SRP7050TA-2R2M: FIXED IND 2.2UH 10A 12 MOHM SMD
R89-R97 = Resistor-Generic-0805-2012: 1/8 Watt Surface Mount Resistor
U6 = IC-LTC-LTC3646-1EMSE#PBF: as U2 on sheet Power-Tree-Main; ComponentLink3Description: Package Specification; PackageReference: MSE-16; ComponentLink2URL: http://cds.linear.com/docs/en/datasheet/36461fa.pdf; ComponentLink1Description: Manufacturer URL; RoHS: TRUE; ComponentLink3URL: http://cds.linear.com/docs/en/packaging/05081667_F_MSE16.pdf; PackageVersion: Rev. F, 05/2013; Mounting Technology: Surface Mount; ComponentLink1URL: http://www.linear.com/; ComponentLink2Description: Datasheet; PackageDescription: 16-Pin Plastic MSOP, Exposed Die Pad, Body 4.039 x 3 mm, Pitch 0.5 mm

## Sheet TM4C.SchDoc
size A3; DocumentNumber: 6-; SheetNumber: 6; SheetTotal: 7
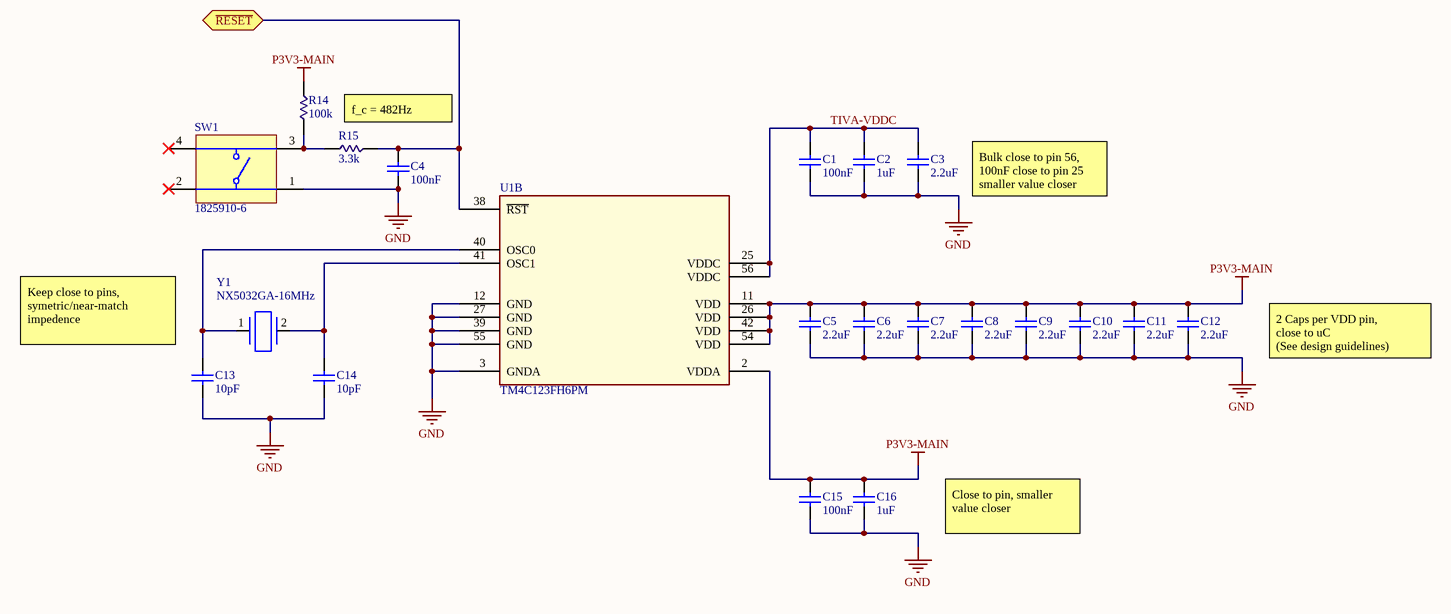
[diagram p5: TM4C.SchDoc]

### Parts
C1  value 100nF  [FOOTPRINT-0805-GEN]  (hidden comment: C0805C104K8RACTU)
C2  value 1uF  [FOOTPRINT-0805-GEN]  (hidden comment: C0805C105K8RACTU)
C3  value 2.2uF  [FOOTPRINT-0805-GEN]  (hidden comment: C0805C225K8RACTU)
C4  value 100nF  [FOOTPRINT-0805-GEN]  (hidden comment: C0805C104K8RACTU)
C5  value 2.2uF  [FOOTPRINT-0805-GEN]  (hidden comment: C0805C225K8RACTU)
C6  value 2.2uF  [FOOTPRINT-0805-GEN]  (hidden comment: C0805C225K8RACTU)
C7  value 2.2uF  [FOOTPRINT-0805-GEN]  (hidden comment: C0805C225K8RACTU)
C8  value 2.2uF  [FOOTPRINT-0805-GEN]  (hidden comment: C0805C225K8RACTU)
C9  value 2.2uF  [FOOTPRINT-0805-GEN]  (hidden comment: C0805C225K8RACTU)
C10  value 2.2uF  [FOOTPRINT-0805-GEN]  (hidden comment: C0805C225K8RACTU)
C11  value 2.2uF  [FOOTPRINT-0805-GEN]  (hidden comment: C0805C225K8RACTU)
C12  value 2.2uF  [FOOTPRINT-0805-GEN]  (hidden comment: C0805C225K8RACTU)
C13  value 10pF  [FOOTPRINT-0805-GEN]  (hidden comment: C0805C100K5RAC7800)
C14  value 10pF  [FOOTPRINT-0805-GEN]  (hidden comment: C0805C100K5RAC7800)
C15  value 100nF  [FOOTPRINT-0805-GEN]  (hidden comment: C0805C104K8RACTU)
C16  value 1uF  [FOOTPRINT-0805-GEN]  (hidden comment: C0805C105K8RACTU)
R14  value 100k  [FOOTPRINT-0805-GEN]  (hidden comment: SMC)
R15  value 3.3k  [FOOTPRINT-0805-GEN]  (hidden comment: SMC)
SW1  1825910-6  [TECO-1825910-6_V]
U1  TM4C123FH6PM  [FOOTPRINT-TI-TM4C123-64-LQFP]  (part B of 2)
Y1  NameShort: NX5032GA-16MHz  [FOOTPRINT-NDK-NX5032GA]  (hidden comment: NX5032GA-16.000000MHZ-LN-CD-1)

### Ports
~{RESET} (bidir)

### Nets
GND: C1.1 C2.1 C3.2 C4.1 C5.2 C6.2 C7.2 C8.2 C9.2 C10.2 C11.2 C12.2 C13.2 C14.2 C15.1 C16.1 SW1.1 U1.3(GNDA) U1.12(GND) U1.27(GND) U1.39(GND) U1.55(GND)
P3V3-MAIN: C5.1 C6.1 C7.1 C8.1 C9.1 C10.1 C11.1 C12.1 C15.2 C16.2 R14.2 U1.2(VDDA) U1.11(VDD) U1.26(VDD) U1.42(VDD) U1.54(VDD)
TIVA-VDDC: C1.2 C2.2 C3.1 U1.25(VDDC) U1.56(VDDC)
NetC4_2: C4.2 R15.2 U1.38(~{RST}) ; port ~{RESET}
NetC13_1: C13.1 U1.40(OSC0) Y1.1(X1)
NetC14_1: C14.1 U1.41(OSC1) Y1.2(X2)
NetR14_1: R14.1 R15.1 SW1.3

Not connected (* = marked no-connect by the designer): SW1 2* 4*

### Notes on the sheet
- f_c = 482Hz
- Bulk close to pin 56, 100nF close to pin 25
  smaller value closer
- (near C13) Keep close to pins, symetric/near-match impedence
- 2 Caps per VDD pin,
  close to uC
  (See design guidelines)
- Close to pin, smaller value closer
- Title
- Size:
- Date:
- A3
- Number:
- Time:
- Revision:
- Sheet
- of
- File:

### Library data of the parts
C1-C16 = Capacitor-Generic-0805: Capacitor; Published: 8-Jun-2000; LatestRevisionDate: 17-Jul-2002; LatestRevisionNote: Re-released for DXP Platform.; PackageReference: RAD-0.3; Publisher: Altium Limited; PackageDescription: Radial Cap, Thru-Hole; 2 Leads; 0.3 in Pin Spacing
R14 R15 = Resistor-Generic-0805-2012: 1/8 Watt Surface Mount Resistor
SW1 = CMP-1684-00021-1: Tact Switch, SPST-NO, 0.05 A, -35 to 85 degC, 4-Pin THD, RoHS, Bulk; Manufacturer: TE Connectivity; Maximum Contact Resistance: 100mOhm; Mechanical Life: 100000Cycles; Bushing Type: Unthreaded; Switch Configuration: OFF(ON); Maximum DC Voltage Rating: 24V; Contact Rating @ Voltage: 0.05A@24VDC; Actuator Color: Black; Body Orientation: Straight; Function: MomentaryContact; Illumination: N/R; Actuator Style: RoundButton; Actuator Material: PolybutyleneTerephthalate; Dielectric Strength: 500VAC; Pole Throw Configuration: SPST; Actuator Length: 1.4mm; Product Weight: N/A; Contact Material: CopperAlloy; Housing Material: N/A; Terminal Type: PCPins; Minimum Insulation Resistance: 100MOhm; Package Description: 4-Pin Through Hole Device, Body 5.99 x 5.99 mm, Pitch 6.5 mm; Part No: 1825910-6; Package Reference: THD; Base Material: N/A; Manufacturer URL: http://www.te.com; Contact Plating: Silver; RoHS: Yes; Datasheet Version: Rev. C9; Electrical Life: 100000Cycles; Maximum AC Voltage Rating: N/A; Thread Size: N/R; Operating Temperature: -35to85C; Mounting: ThroughHole; Dimension: 5.99x5mm; Datasheet URL: http://www.te.com/commerce/DocumentDelivery/DDEController?Action=showdoc&DocId=Customer+Drawing%7F1825910%7FC9%7Fpdf%7FEnglish%7FENG_CD_1825910_C9.pdf%7F1825910-6; Family: 1825910; Seal Location: N/A; Seal Description: N/A; Packaging: N/A
U1 = IC-TI-TM4C123FH6PM
Y1 = Crystal-NDK-NX5032GA-16MHz

## Sheet TM4C-Interfaces.SchDoc
size A3; DocumentNumber: 7-; SheetNumber: 7; SheetTotal: 7
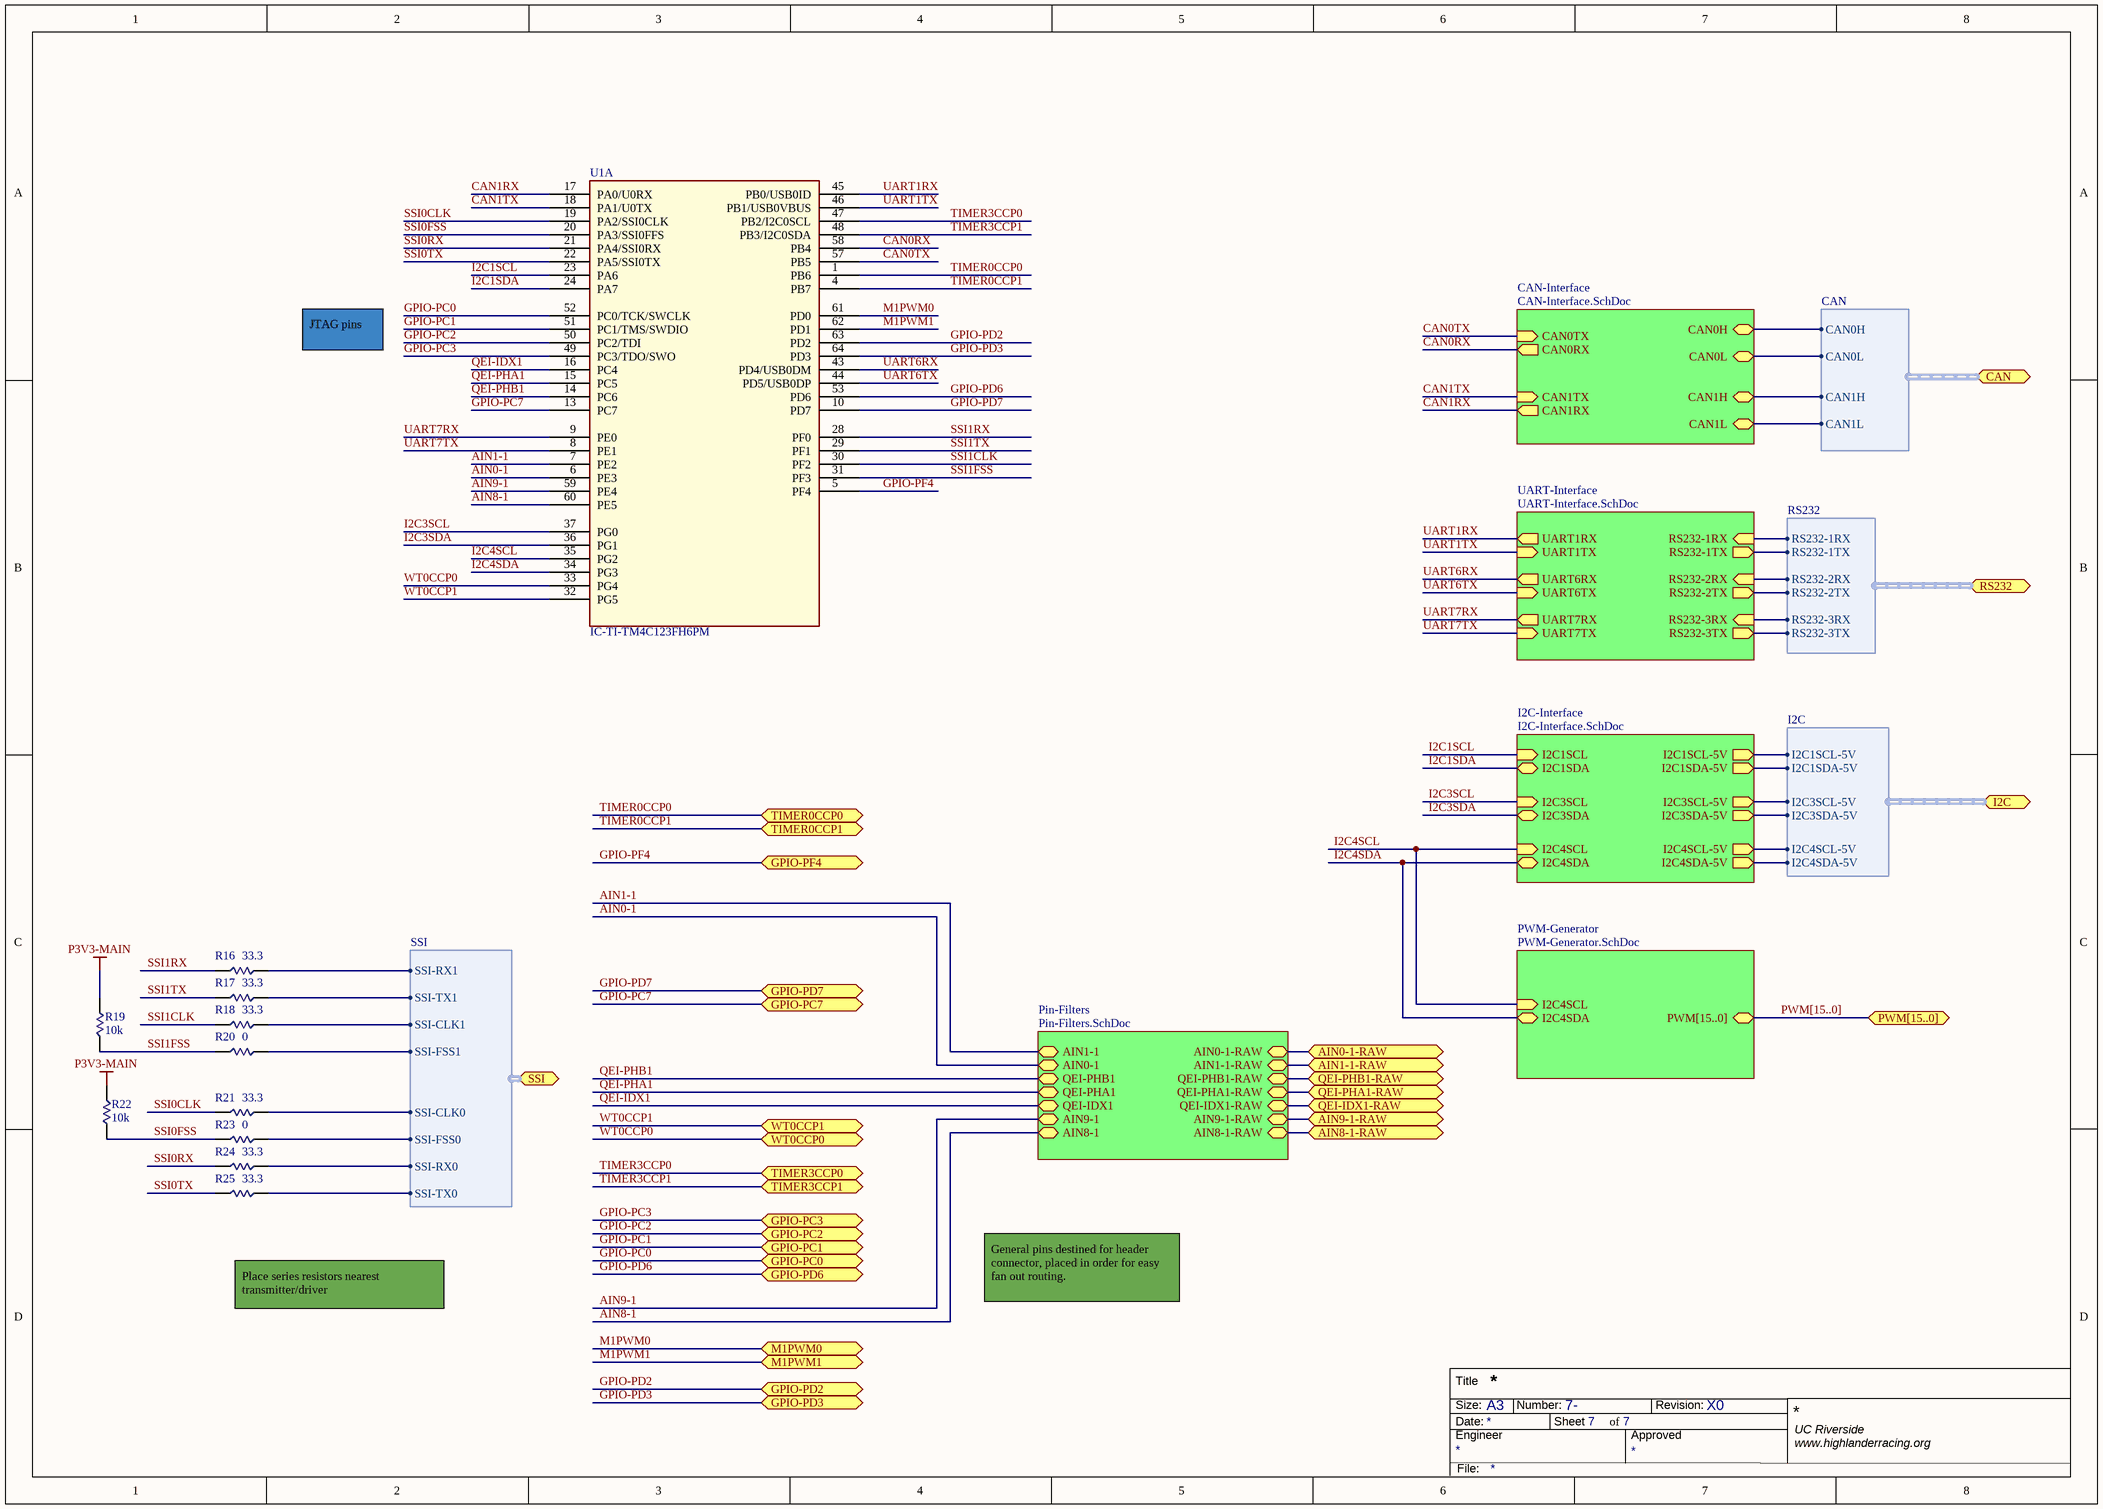
[diagram p6: TM4C-Interfaces.SchDoc]

### Parts
R16  value 33.3  [FOOTPRINT-0805-GEN]  (hidden comment: SMC)
R17  value 33.3  [FOOTPRINT-0805-GEN]  (hidden comment: SMC)
R18  value 33.3  [FOOTPRINT-0805-GEN]  (hidden comment: SMC)
R19  value 10k  [FOOTPRINT-0805-GEN]  (hidden comment: SMC)
R20  value 0  [FOOTPRINT-0805-GEN]  (hidden comment: SMC)
R21  value 33.3  [FOOTPRINT-0805-GEN]  (hidden comment: SMC)
R22  value 10k  [FOOTPRINT-0805-GEN]  (hidden comment: SMC)
R23  value 0  [FOOTPRINT-0805-GEN]  (hidden comment: SMC)
R24  value 33.3  [FOOTPRINT-0805-GEN]  (hidden comment: SMC)
R25  value 33.3  [FOOTPRINT-0805-GEN]  (hidden comment: SMC)
U1  IC-TI-TM4C123FH6PM  [FOOTPRINT-TI-TM4C123-64-LQFP]  (part A of 2)

### Sub-sheets
CAN-Interface = CAN-Interface.SchDoc: CAN0TX (in), CAN0RX (out), CAN1TX (in), CAN1RX (out), CAN0H (bidir), CAN0L (bidir), CAN1H (bidir), CAN1L (bidir)
I2C-Interface = I2C-Interface.SchDoc: I2C1SCL (in), I2C1SDA (bidir), I2C3SCL (in), I2C3SDA (bidir), I2C4SCL (in), I2C4SDA (bidir), I2C1SCL-5V (out), I2C1SDA-5V (out), I2C3SDA-5V (out), I2C3SCL-5V (out), I2C4SCL-5V (out), I2C4SDA-5V (out)
Pin-Filters = Pin-Filters.SchDoc: AIN1-1 (bidir), AIN8-1 (bidir), QEI-PHB1 (bidir), QEI-PHA1 (bidir), AIN0-1 (bidir), QEI-IDX1 (bidir), AIN9-1 (bidir), AIN8-1-RAW (bidir), AIN9-1-RAW (bidir), QEI-IDX1-RAW (bidir), QEI-PHA1-RAW (bidir), QEI-PHB1-RAW (bidir), AIN1-1-RAW (bidir), AIN0-1-RAW (bidir)
PWM-Generator = PWM-Generator.SchDoc: I2C4SCL (in), I2C4SDA (bidir), PWM[15..0] (bidir)
UART-Interface = UART-Interface.SchDoc: UART1RX (out), UART1TX (in), UART6RX (out), UART6TX (in), UART7RX (out), UART7TX (in), RS232-1RX (in), RS232-1TX (out), RS232-2RX (in), RS232-2TX (out), RS232-3RX (in), RS232-3TX (out)

### Ports
AIN0-1-RAW (bidir), AIN1-1-RAW (bidir), AIN8-1-RAW (bidir), AIN9-1-RAW (bidir), CAN (bidir, harness CAN), GPIO-PC0 (bidir), GPIO-PC1 (bidir), GPIO-PC2 (bidir), GPIO-PC3 (bidir), GPIO-PC7 (bidir), GPIO-PD2 (bidir), GPIO-PD3 (bidir), GPIO-PD6 (bidir), GPIO-PD7 (bidir), GPIO-PF4 (bidir), I2C (bidir, harness I2C), M1PWM0 (bidir), M1PWM1 (bidir), PWM[15..0] (bidir), QEI-IDX1-RAW (bidir), QEI-PHA1-RAW (bidir), QEI-PHB1-RAW (bidir), RS232 (bidir, harness RS232), SSI (bidir, harness SSI), TIMER0CCP0 (bidir), TIMER0CCP1 (bidir), TIMER3CCP0 (bidir), TIMER3CCP1 (bidir), WT0CCP0 (bidir), WT0CCP1 (bidir)

### Harnesses
SSI: SSI-TX1, SSI-CLK1, SSI-RX1, SSI-FSS1, SSI-CLK0, SSI-FSS0, SSI-RX0, SSI-TX0
RS232: RS232-1RX, RS232-1TX, RS232-2RX, RS232-2TX, RS232-3RX, RS232-3TX
I2C: I2C1SCL-5V, I2C1SDA-5V, I2C3SCL-5V, I2C3SDA-5V, I2C4SCL-5V, I2C4SDA-5V
CAN: CAN0H, CAN0L, CAN1H, CAN1L

### Nets
P3V3-MAIN: R19.2 R22.2
AIN0-1: U1.6(PE3) ; sheet Pin-Filters/AIN0-1
AIN1-1: U1.7(PE2) ; sheet Pin-Filters/AIN1-1
AIN8-1: U1.60(PE5) ; sheet Pin-Filters/AIN8-1
AIN9-1: U1.59(PE4) ; sheet Pin-Filters/AIN9-1
CAN0RX: U1.58(PB4) ; sheet CAN-Interface/CAN0RX
CAN0TX: U1.57(PB5) ; sheet CAN-Interface/CAN0TX
CAN1RX: U1.17(PA0/U0RX) ; sheet CAN-Interface/CAN1RX
CAN1TX: U1.18(PA1/U0TX) ; sheet CAN-Interface/CAN1TX
GPIO-PC0: U1.52(PC0/TCK/SWCLK) ; port GPIO-PC0
GPIO-PC1: U1.51(PC1/TMS/SWDIO) ; port GPIO-PC1
GPIO-PC2: U1.50(PC2/TDI) ; port GPIO-PC2
GPIO-PC3: U1.49(PC3/TDO/SWO) ; port GPIO-PC3
GPIO-PC7: U1.13(PC7) ; port GPIO-PC7
GPIO-PD2: U1.63(PD2) ; port GPIO-PD2
GPIO-PD3: U1.64(PD3) ; port GPIO-PD3
GPIO-PD6: U1.53(PD6) ; port GPIO-PD6
GPIO-PD7: U1.10(PD7) ; port GPIO-PD7
GPIO-PF4: U1.5(PF4) ; port GPIO-PF4
I2C1SCL: U1.23(PA6) ; sheet I2C-Interface/I2C1SCL
I2C1SDA: U1.24(PA7) ; sheet I2C-Interface/I2C1SDA
I2C3SCL: U1.37(PG0) ; sheet I2C-Interface/I2C3SCL
I2C3SDA: U1.36(PG1) ; sheet I2C-Interface/I2C3SDA
I2C4SCL: U1.35(PG2) ; sheet I2C-Interface/I2C4SCL, sheet PWM-Generator/I2C4SCL
I2C4SDA: U1.34(PG3) ; sheet I2C-Interface/I2C4SDA, sheet PWM-Generator/I2C4SDA
M1PWM0: U1.61(PD0) ; port M1PWM0
M1PWM1: U1.62(PD1) ; port M1PWM1
QEI-IDX1: U1.16(PC4) ; sheet Pin-Filters/QEI-IDX1
QEI-PHA1: U1.15(PC5) ; sheet Pin-Filters/QEI-PHA1
QEI-PHB1: U1.14(PC6) ; sheet Pin-Filters/QEI-PHB1
SSI0CLK: R21.1 U1.19(PA2/SSI0CLK)
SSI0FSS: R22.1 R23.1 U1.20(PA3/SSI0FFS)
SSI0RX: R24.1 U1.21(PA4/SSI0RX)
SSI0TX: R25.1 U1.22(PA5/SSI0TX)
SSI1CLK: R18.1 U1.30(PF2)
SSI1FSS: R19.1 R20.1 U1.31(PF3)
SSI1RX: R16.1 U1.28(PF0)
SSI1TX: R17.1 U1.29(PF1)
TIMER0CCP0: U1.1(PB6) ; port TIMER0CCP0
TIMER0CCP1: U1.4(PB7) ; port TIMER0CCP1
TIMER3CCP0: U1.47(PB2/I2C0SCL) ; port TIMER3CCP0
TIMER3CCP1: U1.48(PB3/I2C0SDA) ; port TIMER3CCP1
UART1RX: U1.45(PB0/USB0ID) ; sheet UART-Interface/UART1RX
UART1TX: U1.46(PB1/USB0VBUS) ; sheet UART-Interface/UART1TX
UART6RX: U1.43(PD4/USB0DM) ; sheet UART-Interface/UART6RX
UART6TX: U1.44(PD5/USB0DP) ; sheet UART-Interface/UART6TX
UART7RX: U1.9(PE0) ; sheet UART-Interface/UART7RX
UART7TX: U1.8(PE1) ; sheet UART-Interface/UART7TX
WT0CCP0: U1.33(PG4) ; port WT0CCP0
WT0CCP1: U1.32(PG5) ; port WT0CCP1
NetP2_1: sheet UART-Interface/RS232-3TX, port RS232.RS232-3TX
NetP2_2: sheet UART-Interface/RS232-3RX, port RS232.RS232-3RX
NetP2_4: sheet UART-Interface/RS232-1TX, port RS232.RS232-1TX
NetP2_5: sheet UART-Interface/RS232-1RX, port RS232.RS232-1RX
NetP2_7: sheet UART-Interface/RS232-2TX, port RS232.RS232-2TX
NetP2_8: sheet UART-Interface/RS232-2RX, port RS232.RS232-2RX
NetP9_3: sheet I2C-Interface/I2C1SDA-5V, port I2C.I2C1SDA-5V
NetP9_4: sheet I2C-Interface/I2C1SCL-5V, port I2C.I2C1SCL-5V
NetP11_1: R21.2 ; port SSI.SSI-CLK0
NetP11_2: R23.2 ; port SSI.SSI-FSS0
NetP11_3: R24.2 ; port SSI.SSI-RX0
NetP11_4: R25.2 ; port SSI.SSI-TX0
NetP11_6: R16.2 ; port SSI.SSI-RX1
NetP11_7: R17.2 ; port SSI.SSI-TX1
NetP11_8: R18.2 ; port SSI.SSI-CLK1
NetP11_9: R20.2 ; port SSI.SSI-FSS1
NetP13_2: sheet I2C-Interface/I2C3SDA-5V, port I2C.I2C3SDA-5V
NetP13_3: sheet I2C-Interface/I2C3SCL-5V, port I2C.I2C3SCL-5V
NetP15_2: sheet I2C-Interface/I2C4SDA-5V, port I2C.I2C4SDA-5V
NetP15_3: sheet I2C-Interface/I2C4SCL-5V, port I2C.I2C4SCL-5V
NetP21_1: port QEI-IDX1-RAW, sheet Pin-Filters/QEI-IDX1-RAW
NetP21_2: port AIN8-1-RAW, sheet Pin-Filters/AIN8-1-RAW
NetP21_3: port QEI-PHA1-RAW, sheet Pin-Filters/QEI-PHA1-RAW
NetP21_4: port AIN9-1-RAW, sheet Pin-Filters/AIN9-1-RAW
NetP21_5: port QEI-PHB1-RAW, sheet Pin-Filters/QEI-PHB1-RAW
NetP21_6: port AIN0-1-RAW, sheet Pin-Filters/AIN0-1-RAW
NetP21_8: port AIN1-1-RAW, sheet Pin-Filters/AIN1-1-RAW
NetP25_1: sheet CAN-Interface/CAN1H, port CAN.CAN1H
NetP25_3: sheet CAN-Interface/CAN1L, port CAN.CAN1L
NetP26_1: sheet CAN-Interface/CAN0H, port CAN.CAN0H
NetP26_3: sheet CAN-Interface/CAN0L, port CAN.CAN0L

### Buses and harness runs
bus PWM[15..0] = port PWM[15..0] = sheet PWM-Generator/PWM[15..0]

### Notes on the sheet
- JTAG pins
- Place series resistors nearest transmitter/driver
- General pins destined for header connector, placed in order for easy fan out routing.
  Place filter circuit elements next to fanout >10mm from header.
- Title
- Size:
- Date:
- Engineer
- A3
- Number:
- Sheet
- of
- Approved
- Revision:
- UC Riverside
- www.highlanderracing.org <http://www.highlanderracing.org>
- File:

### Library data of the parts
R16-R25 = Resistor-Generic-0805-2012: 1/8 Watt Surface Mount Resistor

## Sheet CAN-Interface.SchDoc
size A4
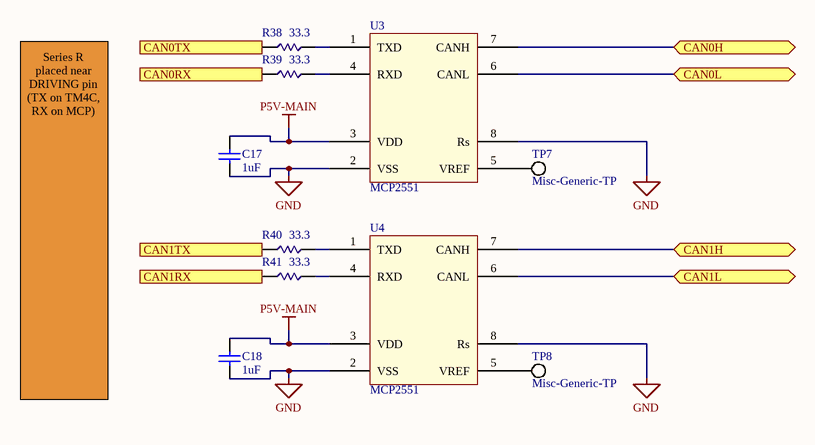
[diagram p7: CAN-Interface.SchDoc]

### Parts
C17  value 1uF  [FOOTPRINT-0805-GEN]  (hidden comment: C0805C105K8RACTU)
C18  value 1uF  [FOOTPRINT-0805-GEN]  (hidden comment: C0805C105K8RACTU)
R38  value 33.3  [FOOTPRINT-0805-GEN]  (hidden comment: SMC)
R39  value 33.3  [FOOTPRINT-0805-GEN]  (hidden comment: SMC)
R40  value 33.3  [FOOTPRINT-0805-GEN]  (hidden comment: SMC)
R41  value 33.3  [FOOTPRINT-0805-GEN]  (hidden comment: SMC)
TP7  Misc-Generic-TP  [FOOTPRINT-GENERIC-TP-SMD-1MM]
TP8  Misc-Generic-TP  [FOOTPRINT-GENERIC-TP-SMD-1MM]
U3  MCP2551  [FOOTPRINT-SOIC-8PIN]
U4  MCP2551  [FOOTPRINT-SOIC-8PIN]

### Ports
CAN0H (bidir), CAN0L (bidir), CAN0RX (out), CAN0TX (in), CAN1H (bidir), CAN1L (bidir), CAN1RX (out), CAN1TX (in)

### Nets
GND: C17.1 C18.1 U3.2(VSS) U3.8(Rs) U4.2(VSS) U4.8(Rs)
P5V-MAIN: C17.2 C18.2 U3.3(VDD) U4.3(VDD)
CAN0RX: R39.1 ; port CAN0RX
CAN0TX: R38.1 ; port CAN0TX
CAN1RX: R41.1 ; port CAN1RX
CAN1TX: R40.1 ; port CAN1TX
NetP25_1: U4.7(CANH) ; port CAN1H
NetP25_3: U4.6(CANL) ; port CAN1L
NetP26_1: U3.7(CANH) ; port CAN0H
NetP26_3: U3.6(CANL) ; port CAN0L
NetR38_2: R38.2 U3.1(TXD)
NetR39_2: R39.2 U3.4(RXD)
NetR40_2: R40.2 U4.1(TXD)
NetR41_2: R41.2 U4.4(RXD)
NetTP7_1: TP7.1(TP) U3.5(VREF)
NetTP8_1: TP8.1(TP) U4.5(VREF)

### Notes on the sheet
- Series R placed near DRIVING pin (TX on TM4C, RX on MCP)
- Title
- Size:
- Date:
- Engineer
- A4
- Number:
- Sheet
- of
- Approved
- Revision:
- UC Riverside
- www.highlanderracing.org <https://www.highlanderracing.org>
- File:

### Library data of the parts
C17 C18 = Capacitor-Generic-0805: Capacitor; Published: 8-Jun-2000; LatestRevisionDate: 17-Jul-2002; LatestRevisionNote: Re-released for DXP Platform.; PackageReference: RAD-0.3; Publisher: Altium Limited; PackageDescription: Radial Cap, Thru-Hole; 2 Leads; 0.3 in Pin Spacing
R38-R41 = Resistor-Generic-0805-2012: 1/8 Watt Surface Mount Resistor
U3 U4 = IC-MCP-MCP2551

## Sheet UART-Interface.SchDoc
size A4
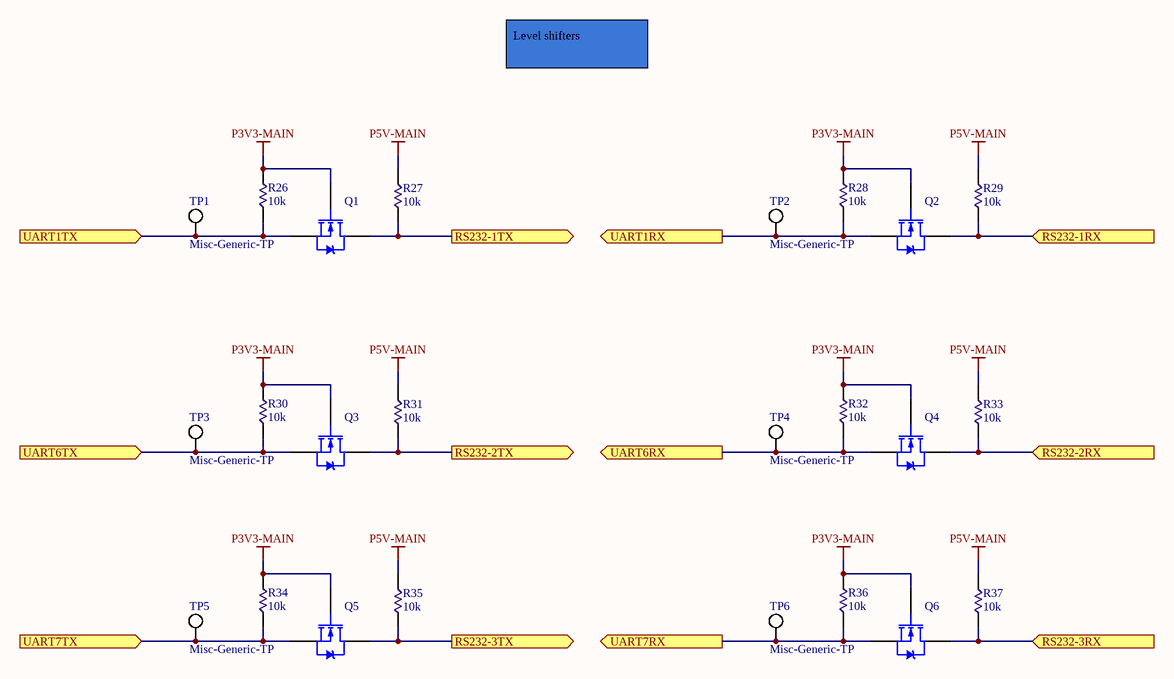
[diagram p8: UART-Interface.SchDoc]

### Parts
Q1  BSS138Q-7-F  [FOOTPRINT-DINC-SOT23-1G2S3D]  (value not drawn)
Q2  BSS138Q-7-F  [FOOTPRINT-DINC-SOT23-1G2S3D]  (value not drawn)
Q3  BSS138Q-7-F  [FOOTPRINT-DINC-SOT23-1G2S3D]  (value not drawn)
Q4  BSS138Q-7-F  [FOOTPRINT-DINC-SOT23-1G2S3D]  (value not drawn)
Q5  BSS138Q-7-F  [FOOTPRINT-DINC-SOT23-1G2S3D]  (value not drawn)
Q6  BSS138Q-7-F  [FOOTPRINT-DINC-SOT23-1G2S3D]  (value not drawn)
R26  value 10k  [FOOTPRINT-0805-GEN]  (hidden comment: SMC)
R27  value 10k  [FOOTPRINT-0805-GEN]  (hidden comment: SMC)
R28  value 10k  [FOOTPRINT-0805-GEN]  (hidden comment: SMC)
R29  value 10k  [FOOTPRINT-0805-GEN]  (hidden comment: SMC)
R30  value 10k  [FOOTPRINT-0805-GEN]  (hidden comment: SMC)
R31  value 10k  [FOOTPRINT-0805-GEN]  (hidden comment: SMC)
R32  value 10k  [FOOTPRINT-0805-GEN]  (hidden comment: SMC)
R33  value 10k  [FOOTPRINT-0805-GEN]  (hidden comment: SMC)
R34  value 10k  [FOOTPRINT-0805-GEN]  (hidden comment: SMC)
R35  value 10k  [FOOTPRINT-0805-GEN]  (hidden comment: SMC)
R36  value 10k  [FOOTPRINT-0805-GEN]  (hidden comment: SMC)
R37  value 10k  [FOOTPRINT-0805-GEN]  (hidden comment: SMC)
TP1  Misc-Generic-TP  [FOOTPRINT-GENERIC-TP-VIA-1MM]
TP2  Misc-Generic-TP  [FOOTPRINT-GENERIC-TP-VIA-1MM]
TP3  Misc-Generic-TP  [FOOTPRINT-GENERIC-TP-VIA-1MM]
TP4  Misc-Generic-TP  [FOOTPRINT-GENERIC-TP-VIA-1MM]
TP5  Misc-Generic-TP  [FOOTPRINT-GENERIC-TP-VIA-1MM]
TP6  Misc-Generic-TP  [FOOTPRINT-GENERIC-TP-VIA-1MM]

### Ports
RS232-1RX (in), RS232-1TX (out), RS232-2RX (in), RS232-2TX (out), RS232-3RX (in), RS232-3TX (out), UART1RX (out), UART1TX (in), UART6RX (out), UART6TX (in), UART7RX (out), UART7TX (in)

### Nets
P3V3-MAIN: Q1.1(G) Q2.1(G) Q3.1(G) Q4.1(G) Q5.1(G) Q6.1(G) R26.2 R28.2 R30.2 R32.2 R34.2 R36.2
P5V-MAIN: R27.1 R29.1 R31.1 R33.1 R35.1 R37.1
UART1RX: Q2.2(S) R28.1 TP2.1(TP) ; port UART1RX
UART1TX: Q1.2(S) R26.1 TP1.1(TP) ; port UART1TX
UART6RX: Q4.2(S) R32.1 TP4.1(TP) ; port UART6RX
UART6TX: Q3.2(S) R30.1 TP3.1(TP) ; port UART6TX
UART7RX: Q6.2(S) R36.1 TP6.1(TP) ; port UART7RX
UART7TX: Q5.2(S) R34.1 TP5.1(TP) ; port UART7TX
NetP2_1: Q5.3(D) R35.2 ; port RS232-3TX
NetP2_2: Q6.3(D) R37.2 ; port RS232-3RX
NetP2_4: Q1.3(D) R27.2 ; port RS232-1TX
NetP2_5: Q2.3(D) R29.2 ; port RS232-1RX
NetP2_7: Q3.3(D) R31.2 ; port RS232-2TX
NetP2_8: Q4.3(D) R33.2 ; port RS232-2RX

### Notes on the sheet
- Level shifters
- Title
- Size:
- Date:
- Engineer
- A4
- Number:
- Sheet
- of
- Approved
- Revision:
- UC Riverside
- www.highlanderracing.org <https://www.highlanderracing.org>
- File:

### Library data of the parts
Q1-Q6 = Transistor-DiodesInc-BSS138-1G2S3D: N-Channel Logic Level Enhancement Mode Field Effect Transistor; Note: Pin 2 is electrically connected to pin 4.; Published: 8-Jun-2000; LatestRevisionDate: 17-Jul-2002; LatestRevisionNote: Re-released for DXP Platform.; DatasheetVersion: PD-9.814; PackageVersion: Feb-1997; PackageReference: TO-220AB; Publisher: Altium Limited; PackageDescription: TO, Thru-Hole, Vertical, Heatsink Mounted; 3 In-Line Leads; Pitch 2.54 mm; ComponentLink1Description: Manufacturer Link; ComponentLink1URL: http://www.irf.com/
R26-R37 = Resistor-Generic-0805-2012: 1/8 Watt Surface Mount Resistor

## Sheet I2C-Interface.SchDoc
size A4
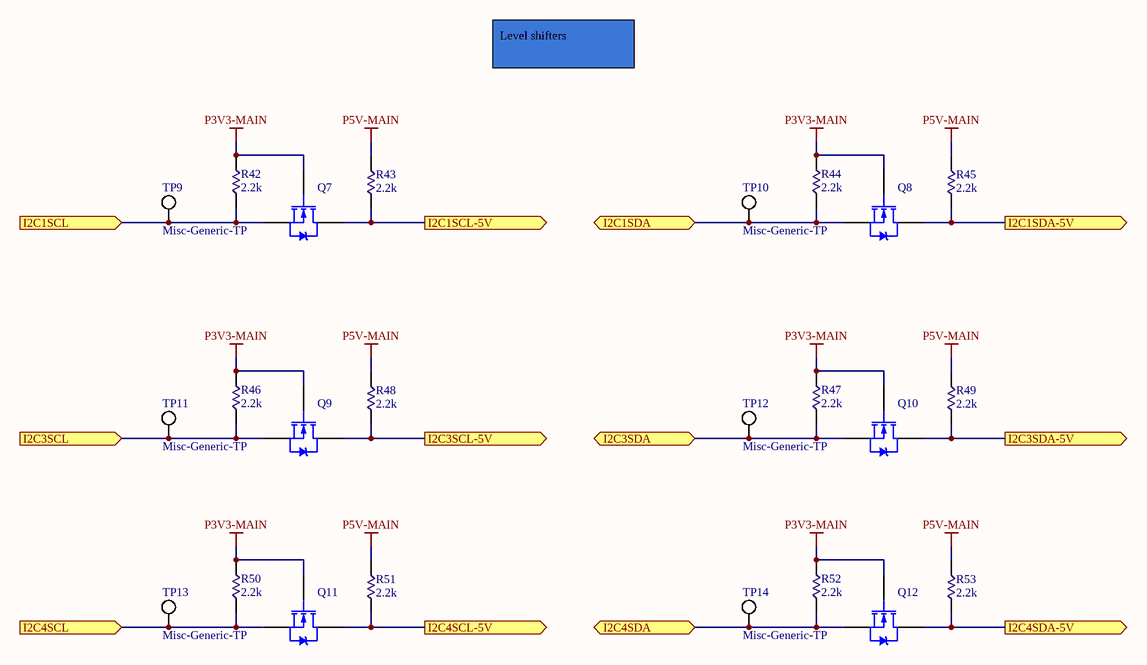
[diagram p9: I2C-Interface.SchDoc]

### Parts
Q7  BSS138Q-7-F  [FOOTPRINT-DINC-SOT23-1G2S3D]  (value not drawn)
Q8  BSS138Q-7-F  [FOOTPRINT-DINC-SOT23-1G2S3D]  (value not drawn)
Q9  BSS138Q-7-F  [FOOTPRINT-DINC-SOT23-1G2S3D]  (value not drawn)
Q10  BSS138Q-7-F  [FOOTPRINT-DINC-SOT23-1G2S3D]  (value not drawn)
Q11  BSS138Q-7-F  [FOOTPRINT-DINC-SOT23-1G2S3D]  (value not drawn)
Q12  BSS138Q-7-F  [FOOTPRINT-DINC-SOT23-1G2S3D]  (value not drawn)
R42  value 2.2k  [FOOTPRINT-0805-GEN]  (hidden comment: SMC)
R43  value 2.2k  [FOOTPRINT-0805-GEN]  (hidden comment: SMC)
R44  value 2.2k  [FOOTPRINT-0805-GEN]  (hidden comment: SMC)
R45  value 2.2k  [FOOTPRINT-0805-GEN]  (hidden comment: SMC)
R46  value 2.2k  [FOOTPRINT-0805-GEN]  (hidden comment: SMC)
R47  value 2.2k  [FOOTPRINT-0805-GEN]  (hidden comment: SMC)
R48  value 2.2k  [FOOTPRINT-0805-GEN]  (hidden comment: SMC)
R49  value 2.2k  [FOOTPRINT-0805-GEN]  (hidden comment: SMC)
R50  value 2.2k  [FOOTPRINT-0805-GEN]  (hidden comment: SMC)
R51  value 2.2k  [FOOTPRINT-0805-GEN]  (hidden comment: SMC)
R52  value 2.2k  [FOOTPRINT-0805-GEN]  (hidden comment: SMC)
R53  value 2.2k  [FOOTPRINT-0805-GEN]  (hidden comment: SMC)
TP9  Misc-Generic-TP  [FOOTPRINT-GENERIC-TP-VIA-1MM]
TP10  Misc-Generic-TP  [FOOTPRINT-GENERIC-TP-VIA-1MM]
TP11  Misc-Generic-TP  [FOOTPRINT-GENERIC-TP-VIA-1MM]
TP12  Misc-Generic-TP  [FOOTPRINT-GENERIC-TP-VIA-1MM]
TP13  Misc-Generic-TP  [FOOTPRINT-GENERIC-TP-VIA-1MM]
TP14  Misc-Generic-TP  [FOOTPRINT-GENERIC-TP-VIA-1MM]

### Ports
I2C1SCL (in), I2C1SCL-5V (out), I2C1SDA (bidir), I2C1SDA-5V (out), I2C3SCL (in), I2C3SCL-5V (out), I2C3SDA (bidir), I2C3SDA-5V (out), I2C4SCL (in), I2C4SCL-5V (out), I2C4SDA (bidir), I2C4SDA-5V (out)

### Nets
P3V3-MAIN: Q7.1(G) Q8.1(G) Q9.1(G) Q10.1(G) Q11.1(G) Q12.1(G) R42.2 R44.2 R46.2 R47.2 R50.2 R52.2
P5V-MAIN: R43.1 R45.1 R48.1 R49.1 R51.1 R53.1
I2C1SCL: Q7.2(S) R42.1 TP9.1(TP) ; port I2C1SCL
I2C1SDA: Q8.2(S) R44.1 TP10.1(TP) ; port I2C1SDA
I2C3SCL: Q9.2(S) R46.1 TP11.1(TP) ; port I2C3SCL
I2C3SDA: Q10.2(S) R47.1 TP12.1(TP) ; port I2C3SDA
I2C4SCL: Q11.2(S) R50.1 TP13.1(TP) ; port I2C4SCL
I2C4SDA: Q12.2(S) R52.1 TP14.1(TP) ; port I2C4SDA
NetP9_3: Q8.3(D) R45.2 ; port I2C1SDA-5V
NetP9_4: Q7.3(D) R43.2 ; port I2C1SCL-5V
NetP13_2: Q10.3(D) R49.2 ; port I2C3SDA-5V
NetP13_3: Q9.3(D) R48.2 ; port I2C3SCL-5V
NetP15_2: Q12.3(D) R53.2 ; port I2C4SDA-5V
NetP15_3: Q11.3(D) R51.2 ; port I2C4SCL-5V

### Notes on the sheet
- Level shifters
- Title
- Size:
- Date:
- Engineer
- A4
- Number:
- Sheet
- of
- Approved
- Revision:
- UC Riverside
- www.highlanderracing.org <https://www.highlanderracing.org>
- File:

### Library data of the parts
Q7-Q12 = Transistor-DiodesInc-BSS138-1G2S3D: as Q1 on sheet UART-Interface; Published: 8-Jun-2000; LatestRevisionDate: 17-Jul-2002; LatestRevisionNote: Re-released for DXP Platform.; DatasheetVersion: PD-9.814; PackageVersion: Feb-1997; PackageReference: TO-220AB; Publisher: Altium Limited; PackageDescription: TO, Thru-Hole, Vertical, Heatsink Mounted; 3 In-Line Leads; Pitch 2.54 mm; ComponentLink1Description: Manufacturer Link; ComponentLink1URL: http://www.irf.com/
R42-R53 = Resistor-Generic-0805-2012: 1/8 Watt Surface Mount Resistor

## Sheet Pin-Filters.SchDoc
size A4
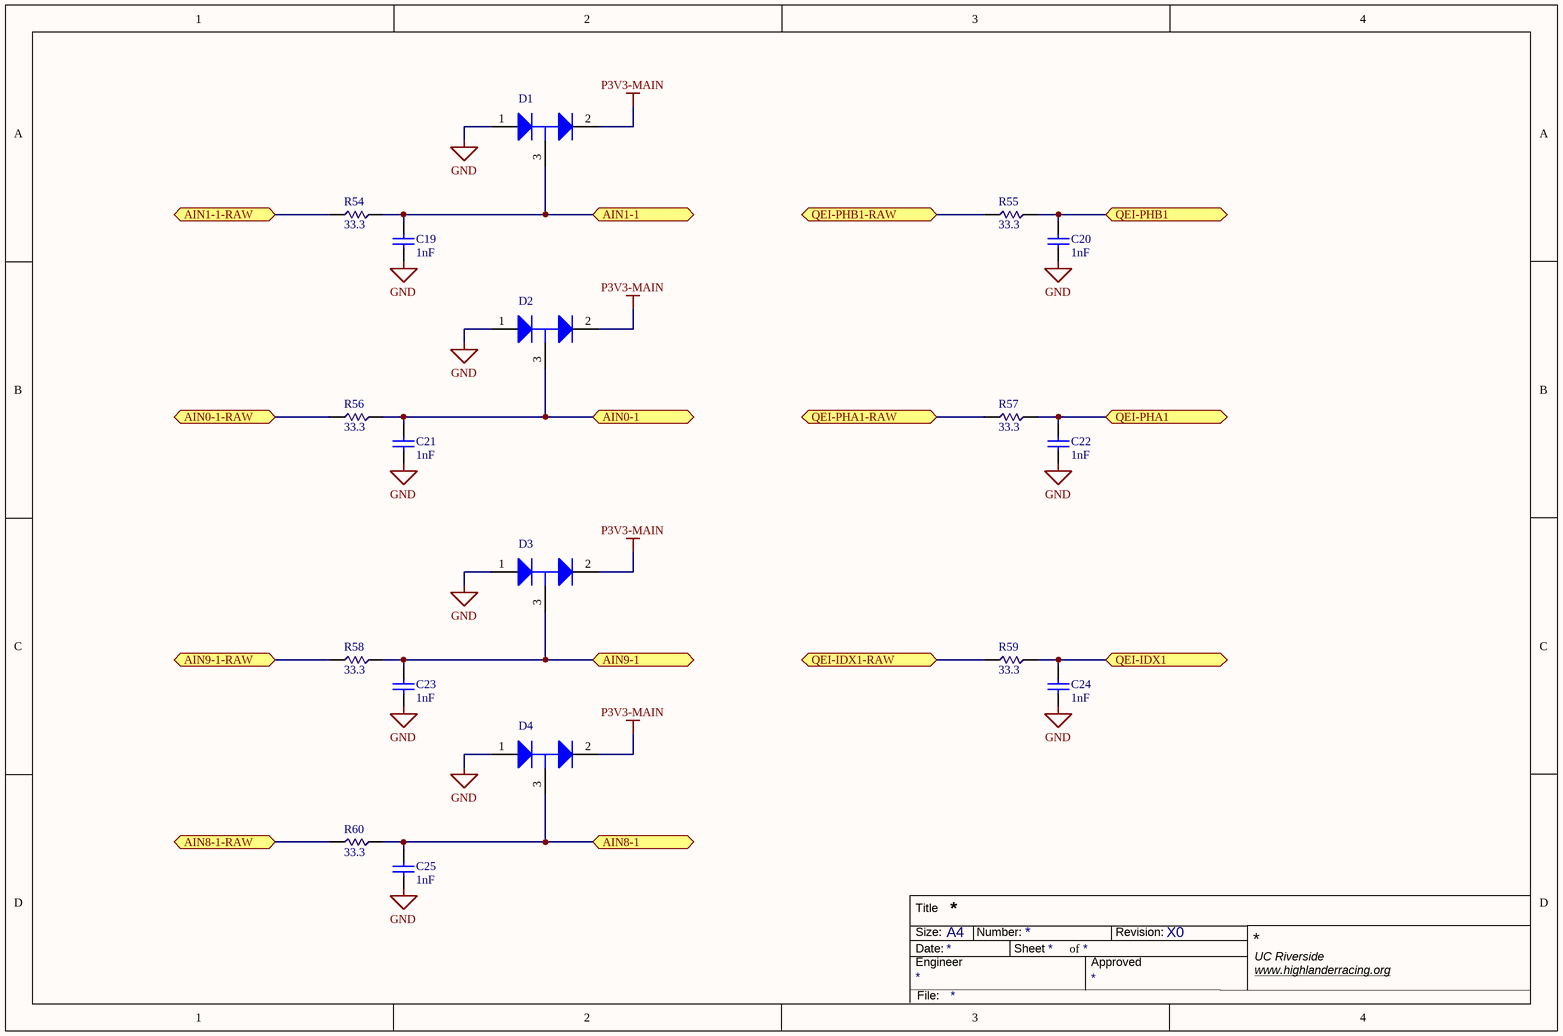
[diagram p10: Pin-Filters.SchDoc]

### Parts
C19  value 1nF  [FOOTPRINT-0805-GEN]  (hidden comment: Capacitor-Generic-0805)
C20  value 1nF  [FOOTPRINT-0805-GEN]  (hidden comment: Capacitor-Generic-0805)
C21  value 1nF  [FOOTPRINT-0805-GEN]  (hidden comment: Capacitor-Generic-0805)
C22  value 1nF  [FOOTPRINT-0805-GEN]  (hidden comment: Capacitor-Generic-0805)
C23  value 1nF  [FOOTPRINT-0805-GEN]  (hidden comment: Capacitor-Generic-0805)
C24  value 1nF  [FOOTPRINT-0805-GEN]  (hidden comment: Capacitor-Generic-0805)
C25  value 1nF  [FOOTPRINT-0805-GEN]  (hidden comment: Capacitor-Generic-0805)
D1  BAT54SLT1G  [FOOTPRINT-ONSC-SOT23-1A2KA3K]  (value not drawn)
D2  BAT54SLT1G  [FOOTPRINT-ONSC-SOT23-1A2KA3K]  (value not drawn)
D3  BAT54SLT1G  [FOOTPRINT-ONSC-SOT23-1A2KA3K]  (value not drawn)
D4  BAT54SLT1G  [FOOTPRINT-ONSC-SOT23-1A2KA3K]  (value not drawn)
R54  value 33.3  [FOOTPRINT-0805-GEN]  (hidden comment: SMC)
R55  value 33.3  [FOOTPRINT-0805-GEN]  (hidden comment: SMC)
R56  value 33.3  [FOOTPRINT-0805-GEN]  (hidden comment: SMC)
R57  value 33.3  [FOOTPRINT-0805-GEN]  (hidden comment: SMC)
R58  value 33.3  [FOOTPRINT-0805-GEN]  (hidden comment: SMC)
R59  value 33.3  [FOOTPRINT-0805-GEN]  (hidden comment: SMC)
R60  value 33.3  [FOOTPRINT-0805-GEN]  (hidden comment: SMC)

### Ports
AIN0-1 (bidir), AIN0-1-RAW (bidir), AIN1-1 (bidir), AIN1-1-RAW (bidir), AIN8-1 (bidir), AIN8-1-RAW (bidir), AIN9-1 (bidir), AIN9-1-RAW (bidir), QEI-IDX1 (bidir), QEI-IDX1-RAW (bidir), QEI-PHA1 (bidir), QEI-PHA1-RAW (bidir), QEI-PHB1 (bidir), QEI-PHB1-RAW (bidir)

### Nets
GND: C19.1 C20.1 C21.1 C22.1 C23.1 C24.1 C25.1 D1.1(A) D2.1(A) D3.1(A) D4.1(A)
P3V3-MAIN: D1.2(K) D2.2(K) D3.2(K) D4.2(K)
AIN0-1: C21.2 D2.3(K/A) R56.2 ; port AIN0-1
AIN1-1: C19.2 D1.3(K/A) R54.2 ; port AIN1-1
AIN8-1: C25.2 D4.3(K/A) R60.2 ; port AIN8-1
AIN9-1: C23.2 D3.3(K/A) R58.2 ; port AIN9-1
QEI-IDX1: C24.2 R59.2 ; port QEI-IDX1
QEI-PHA1: C22.2 R57.2 ; port QEI-PHA1
QEI-PHB1: C20.2 R55.2 ; port QEI-PHB1
NetP21_1: R59.1 ; port QEI-IDX1-RAW
NetP21_2: R60.1 ; port AIN8-1-RAW
NetP21_3: R57.1 ; port QEI-PHA1-RAW
NetP21_4: R58.1 ; port AIN9-1-RAW
NetP21_5: R55.1 ; port QEI-PHB1-RAW
NetP21_6: R56.1 ; port AIN0-1-RAW
NetP21_8: R54.1 ; port AIN1-1-RAW

### Notes on the sheet
- Title
- Size:
- Date:
- Engineer
- A4
- Number:
- Sheet
- of
- Approved
- Revision:
- UC Riverside
- www.highlanderracing.org <https://www.highlanderracing.org>
- File:

### Library data of the parts
C19-C25 = Capacitor-Generic-0805: Capacitor; Published: 8-Jun-2000; LatestRevisionDate: 17-Jul-2002; LatestRevisionNote: Re-released for DXP Platform.; PackageReference: RAD-0.3; Publisher: Altium Limited; PackageDescription: Radial Cap, Thru-Hole; 2 Leads; 0.3 in Pin Spacing
D1-D4 = Diode-ONSC-BAT54S: Dual Series Schottky Barrier Diodes, 3-Pin SOT-23, Pb-Free, Tape and Reel; Manufacturer: On Semiconductor; IFSM Max (A): 0.6; trr Max (ns): 5; DatasheetVersion: Rev. 15; ComponentLink3Description: Package Specification; ComponentLink1URL: http://www.onsemi.com/; ComponentLink1Description: Manufacturer URL; PackageDescription: 3-Pin Small Outline Transistor, Body 2.92 x 1.3 mm, Pitch 0.95 mm; Configuration: Dual; ComponentLink2Description: Datasheet; RoHS: TRUE; ComponentLink3URL: http://www.onsemi.cn/pub_link/Collateral/318-08.PDF; PackageVersion: Rev. AP, 11/2009; Packing: Tape and Reel; PartNumber: BAT54SLT1G; PackageReference: SOT-23-3-318-08; ComponentLink2URL: http://www.onsemi.cn/pub_link/Collateral/BAT54SLT1-D.PDF; Mounting Technology: Surface Mount
R54-R60 = Resistor-Generic-0805-2012: 1/8 Watt Surface Mount Resistor